# EAGLE design fpga_linux (EAGLE 9.3.2)
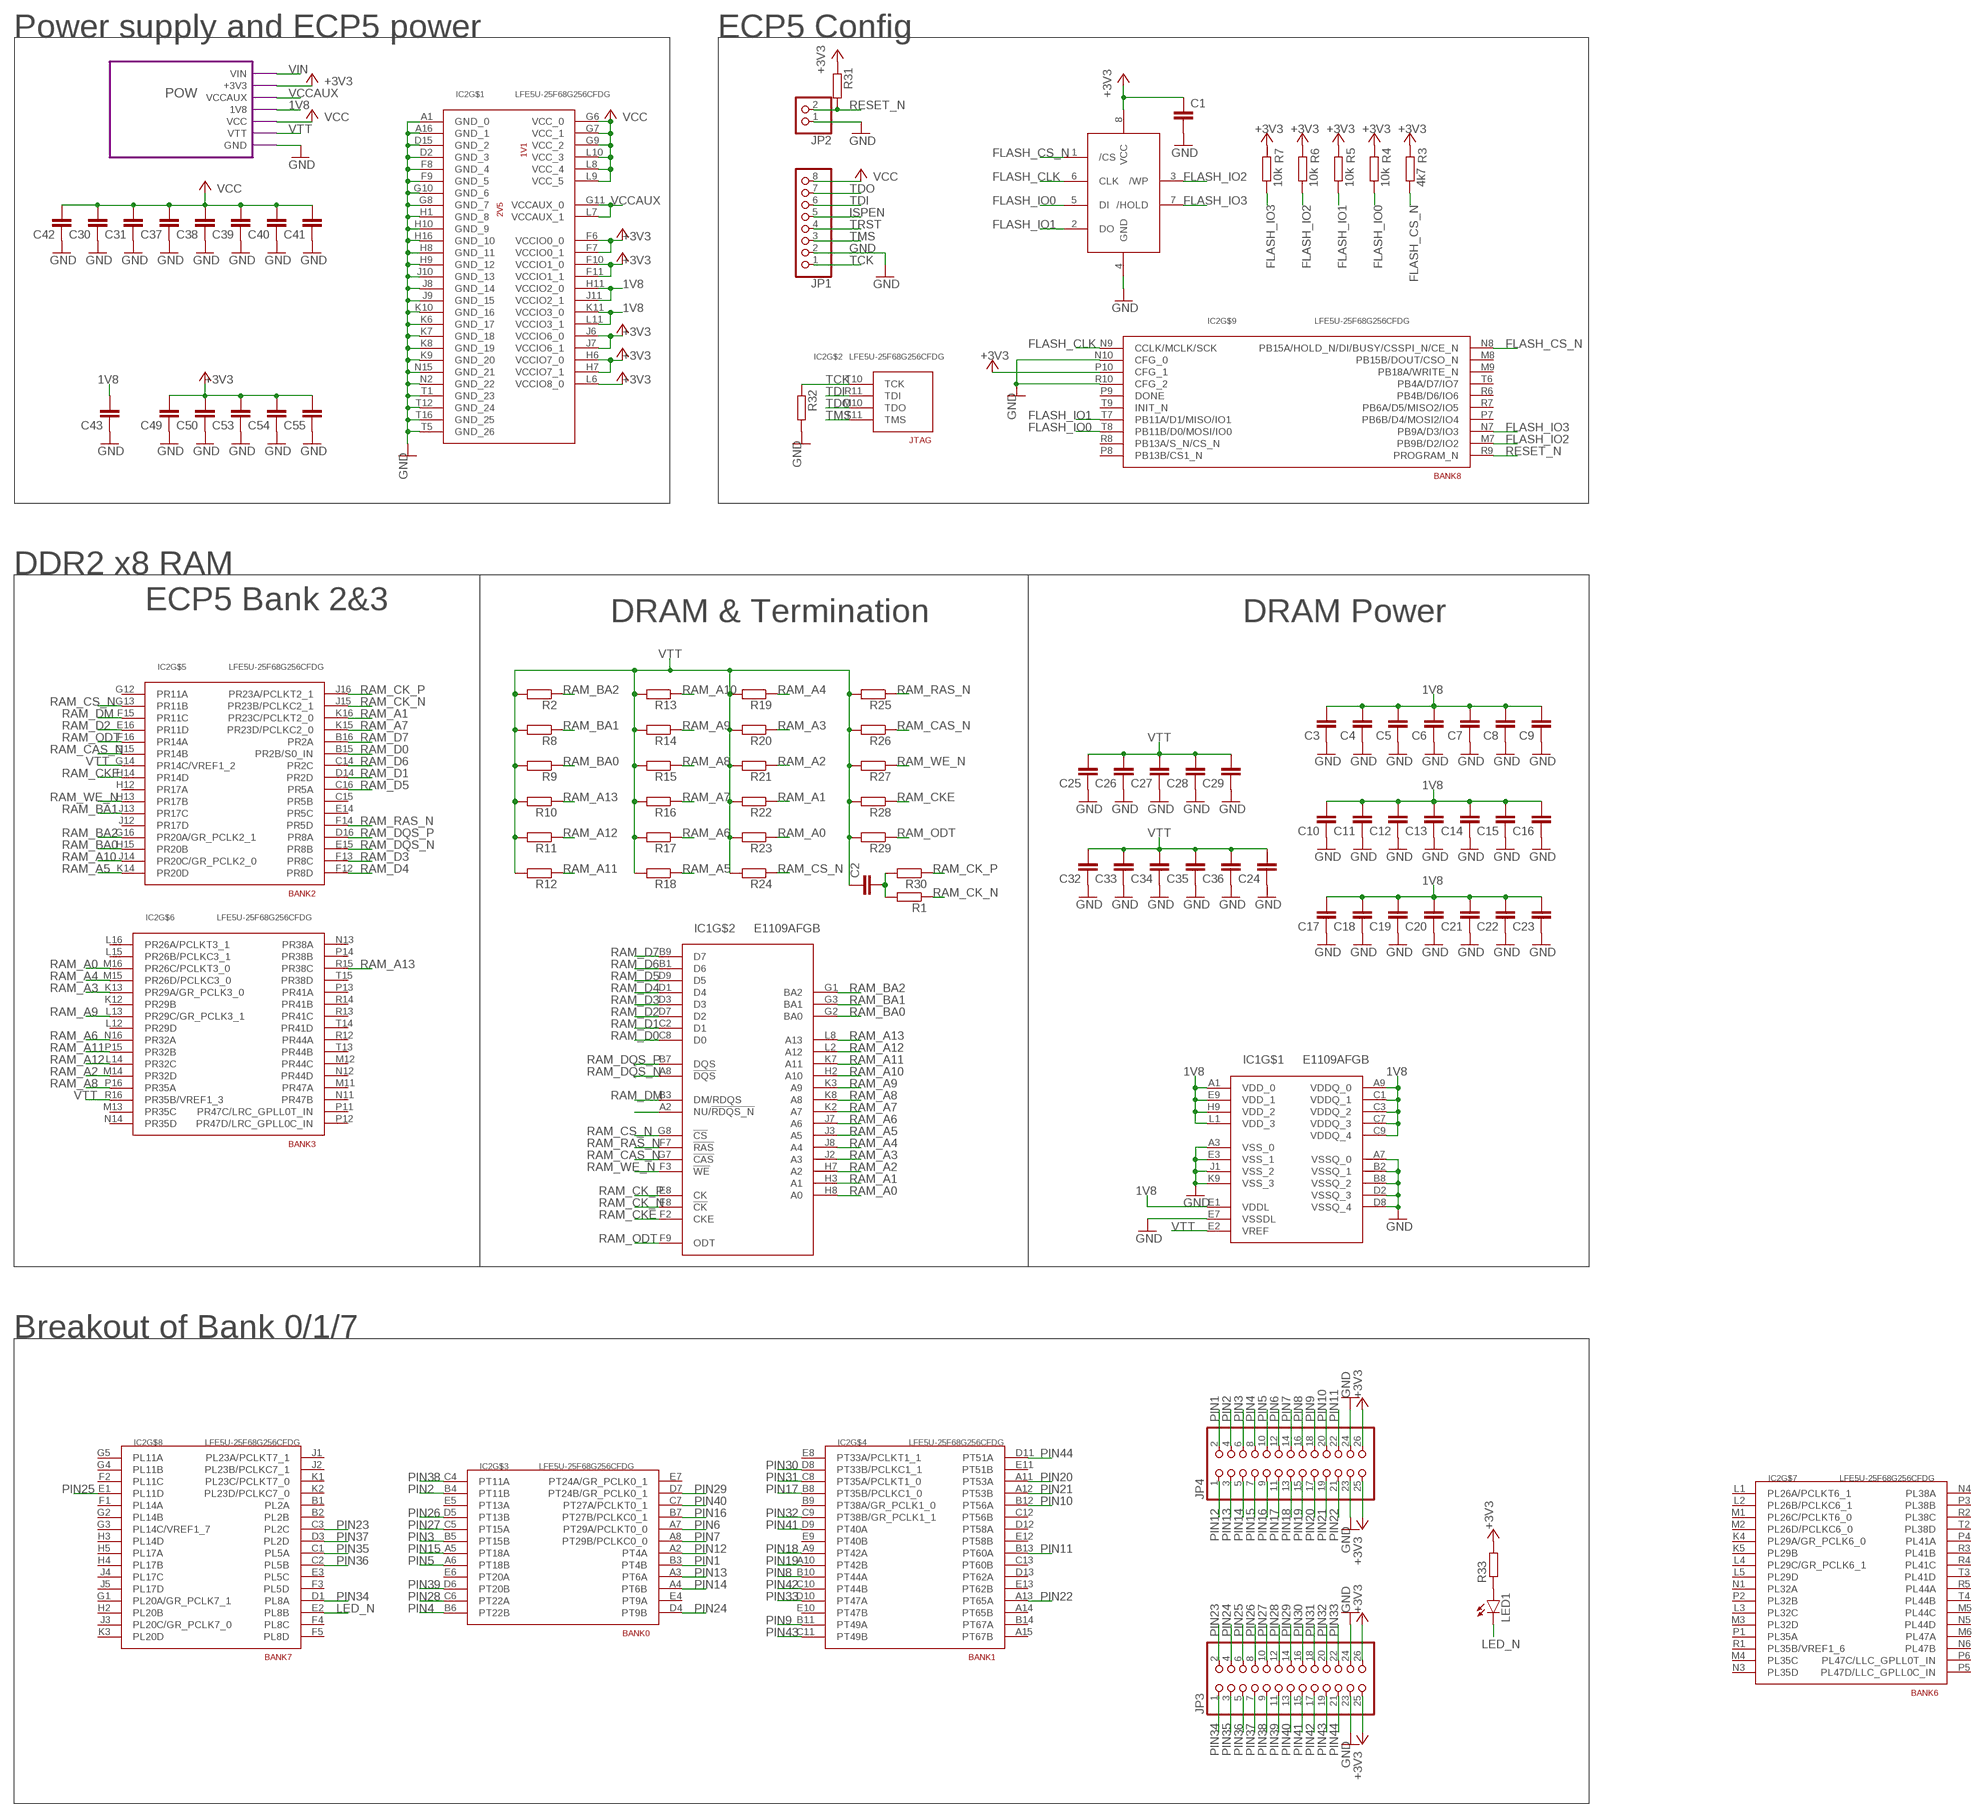
[diagram p0: schematic, sheet 1]

## Parts
C1  C0402  [0402]
C2  C0402  [0402]
C3  C0402  [0402]
C4  C0402  [0402]
C5  C0402  [0402]
C6  C0402  [0402]
C7  C0402  [0402]
C8  C0402  [0402]
C9  C0402  [0402]
C10  C0402  [0402]
C11  C0402  [0402]
C12  C0402  [0402]
C13  C0402  [0402]
C14  C0402  [0402]
C15  C0402  [0402]
C16  C0402  [0402]
C17  C0402  [0402]
C18  C0402  [0402]
C19  C0402  [0402]
C20  C0402  [0402]
C21  C0402  [0402]
C22  C0402  [0402]
C23  C0402  [0402]
C24  C0402  [0402]
C25  C0402  [0402]
C26  C0402  [0402]
C27  C0402  [0402]
C28  C0402  [0402]
C29  C0402  [0402]
C30  C0402  [0402]
C31  C0402  [0402]
C32  C0402  [0402]
C33  C0402  [0402]
C34  C0402  [0402]
C35  C0402  [0402]
C36  C0402  [0402]
C37  C0402  [0402]
C38  C0402  [0402]
C39  C0402  [0402]
C40  C0402  [0402]
C41  C0402  [0402]
C42  C0402  [0402]
C43  C0402  [0402]
C49  C0402  [0402]
C50  C0402  [0402]
C53  C0402  [0402]
C54  C0402  [0402]
C55  C0402  [0402]
IC1  E1109AFGB  [DDR2X8]
IC2  LFE5U-25F68G256CFDG  [BGA256C80P16X16_1400X1400X170]
JP1  PINHD-1X8  [1X08]
JP2  PINHD-1X2  [1X02]
JP3  PINHD-2X13  [2X13]
JP4  PINHD-2X13  [2X13]
LED1  LEDCHIP-LED0603  [CHIP-LED0603]
R1  R0402  [0402]
R2  R0402  [0402]
R3  4k7  R0402  [0402]
R4  10k  R0402  [0402]
R5  10k  R0402  [0402]
R6  10k  R0402  [0402]
R7  10k  R0402  [0402]
R8  R0402  [0402]
R9  R0402  [0402]
R10  R0402  [0402]
R11  R0402  [0402]
R12  R0402  [0402]
R13  R0402  [0402]
R14  R0402  [0402]
R15  R0402  [0402]
R16  R0402  [0402]
R17  R0402  [0402]
R18  R0402  [0402]
R19  R0402  [0402]
R20  R0402  [0402]
R21  R0402  [0402]
R22  R0402  [0402]
R23  R0402  [0402]
R24  R0402  [0402]
R25  R0402  [0402]
R26  R0402  [0402]
R27  R0402  [0402]
R28  R0402  [0402]
R29  R0402  [0402]
R30  R0402  [0402]
R31  R0402  [0402]
R32  R0402  [0402]
R33  R0402  [0402]
U$1  W25Q64FCSOIC8  [SOIC8]

## Module instances
POW = POW

## Nets
1V8: C3.2 C4.2 C5.2 C6.2 C7.2 C8.2 C9.2 C10.2 C11.2 C12.2 C13.2 C14.2 C15.2 C16.2 C17.2 C18.2 C19.2 C20.2 C21.2 C22.2 C23.2 C43.2 IC1.A1(VDD_0) IC1.A9(VDDQ_0) IC1.C1(VDDQ_1) IC1.C3(VDDQ_2) IC1.C7(VDDQ_3) IC1.C9(VDDQ_4) IC1.E1(VDDL) IC1.E9(VDD_1) IC1.H9(VDD_2) IC1.L1(VDD_3) IC2.H11(VCCIO2_0) IC2.J11(VCCIO2_1) IC2.K11(VCCIO3_0) IC2.L11(VCCIO3_1) ; port POW.1V8
+3V3: C1.1 C49.2 C50.2 C53.2 C54.2 C55.2 IC2.F6(VCCIO0_0) IC2.F7(VCCIO0_1) IC2.F10(VCCIO1_0) IC2.F11(VCCIO1_1) IC2.H6(VCCIO7_0) IC2.H7(VCCIO7_1) IC2.J6(VCCIO6_0) IC2.J7(VCCIO6_1) IC2.L6(VCCIO8_0) IC2.P10(CFG_1) JP3.25 JP3.26 JP4.25 JP4.26 R3.1 R4.1 R5.1 R6.1 R7.1 R31.2 R33.1 U$1.8(VCC) ; port POW.+3V3
FLASH_CLK: IC2.N9(CCLK/MCLK/SCK) U$1.6(CLK)
FLASH_CS_N: IC2.N8(PB15A/HOLD_N/DI/BUSY/CSSPI_N/CE_N) R3.2 U$1.1(/CS)
FLASH_IO0: IC2.T8(PB11B/D0/MOSI/IO0) R4.2 U$1.5(DI)
FLASH_IO1: IC2.T7(PB11A/D1/MISO/IO1) R5.2 U$1.2(DO)
FLASH_IO2: IC2.M7(PB9B/D2/IO2) R6.2 U$1.3(/WP)
FLASH_IO3: IC2.N7(PB9A/D3/IO3) R7.2 U$1.7(/HOLD)
GND: C1.2 C3.1 C4.1 C5.1 C6.1 C7.1 C8.1 C9.1 C10.1 C11.1 C12.1 C13.1 C14.1 C15.1 C16.1 C17.1 C18.1 C19.1 C20.1 C21.1 C22.1 C23.1 C24.1 C25.1 C26.1 C27.1 C28.1 C29.1 C30.1 C31.1 C32.1 C33.1 C34.1 C35.1 C36.1 C37.1 C38.1 C39.1 C40.1 C41.1 C42.1 C43.1 C49.1 C50.1 C53.1 C54.1 C55.1 IC1.A3(VSS_0) IC1.A7(VSSQ_0) IC1.B2(VSSQ_1) IC1.B8(VSSQ_2) IC1.D2(VSSQ_3) IC1.D8(VSSQ_4) IC1.E3(VSS_1) IC1.E7(VSSDL) IC1.J1(VSS_2) IC1.K9(VSS_3) IC2.A1(GND_0) IC2.A16(GND_1) IC2.D2(GND_3) IC2.D15(GND_2) IC2.F8(GND_4) IC2.F9(GND_5) IC2.G8(GND_7) IC2.G10(GND_6) IC2.H1(GND_8) IC2.H8(GND_11) IC2.H9(GND_12) IC2.H10(GND_9) IC2.H16(GND_10) IC2.J8(GND_14) IC2.J9(GND_15) IC2.J10(GND_13) IC2.K6(GND_17) IC2.K7(GND_18) IC2.K8(GND_19) IC2.K9(GND_20) IC2.K10(GND_16) IC2.N2(GND_22) IC2.N10(CFG_0) IC2.N15(GND_21) IC2.R10(CFG_2) IC2.T1(GND_23) IC2.T5(GND_26) IC2.T12(GND_24) IC2.T16(GND_25) JP1.2 JP2.1 JP3.23 JP3.24 JP4.23 JP4.24 R32.1 U$1.4(GND) ; port POW.GND
ISPEN: JP1.5
LED_N: IC2.E2(PL8B) LED1.C
N$1: C2.2 R1.1 R30.1
N$2: LED1.A R33.2
N$30: IC1.A2(NU/!RDQS_N)
PIN1: IC2.B3(PT4B) JP4.2
PIN2: IC2.B4(PT11B) JP4.4
PIN3: IC2.B5(PT15B) JP4.6
PIN4: IC2.B6(PT22B) JP4.8
PIN5: IC2.A6(PT18B) JP4.10
PIN6: IC2.A7(PT29A/PCLKT0_0) JP4.12
PIN7: IC2.A8(PT29B/PCLKC0_0) JP4.14
PIN8: IC2.B10(PT44A) JP4.16
PIN9: IC2.B11(PT49A) JP4.18
PIN10: IC2.B12(PT56A) JP4.20
PIN11: IC2.B13(PT60A) JP4.22
PIN12: IC2.A2(PT4A) JP4.1
PIN13: IC2.A3(PT6A) JP4.3
PIN14: IC2.A4(PT6B) JP4.5
PIN15: IC2.A5(PT18A) JP4.7
PIN16: IC2.B7(PT27B/PCLKC0_1) JP4.9
PIN17: IC2.B8(PT35B/PCLKC1_0) JP4.11
PIN18: IC2.A9(PT42A) JP4.13
PIN19: IC2.A10(PT42B) JP4.15
PIN20: IC2.A11(PT53A) JP4.17
PIN21: IC2.A12(PT53B) JP4.19
PIN22: IC2.A13(PT65A) JP4.21
PIN23: IC2.C3(PL2C) JP3.2
PIN24: IC2.D4(PT9B) JP3.4
PIN25: IC2.E1(PL11D) JP3.6
PIN26: IC2.D5(PT13B) JP3.8
PIN27: IC2.C5(PT15A) JP3.10
PIN28: IC2.C6(PT22A) JP3.12
PIN29: IC2.D7(PT24B/GR_PCLK0_1) JP3.14
PIN30: IC2.D8(PT33B/PCLKC1_1) JP3.16
PIN31: IC2.C8(PT35A/PCLKT1_0) JP3.18
PIN32: IC2.C9(PT38B/GR_PCLK1_1) JP3.20
PIN33: IC2.D10(PT47A) JP3.22
PIN34: IC2.D1(PL8A) JP3.1
PIN35: IC2.C1(PL5A) JP3.3
PIN36: IC2.C2(PL5B) JP3.5
PIN37: IC2.D3(PL2D) JP3.7
PIN38: IC2.C4(PT11A) JP3.9
PIN39: IC2.D6(PT20B) JP3.11
PIN40: IC2.C7(PT27A/PCLKT0_1) JP3.13
PIN41: IC2.D9(PT40A) JP3.15
PIN42: IC2.C10(PT44B) JP3.17
PIN43: IC2.C11(PT49B) JP3.19
PIN44: IC2.D11(PT51A) JP3.21
RAM_A0: IC1.H8(A0) IC2.M16(PR26C/PCLKT3_0) R23.2
RAM_A1: IC1.H3(A1) IC2.K16(PR23C/PCLKT2_0) R22.2
RAM_A2: IC1.H7(A2) IC2.M14(PR32D) R21.2
RAM_A3: IC1.J2(A3) IC2.K13(PR29A/GR_PCLK3_0) R20.2
RAM_A4: IC1.J8(A4) IC2.M15(PR26D/PCLKC3_0) R19.2
RAM_A5: IC1.J3(A5) IC2.K14(PR20D) R18.2
RAM_A6: IC1.J7(A6) IC2.N16(PR32A) R17.2
RAM_A7: IC1.K2(A7) IC2.K15(PR23D/PCLKC2_0) R16.2
RAM_A8: IC1.K8(A8) IC2.P16(PR35A) R15.2
RAM_A9: IC1.K3(A9) IC2.L13(PR29C/GR_PCLK3_1) R14.2
RAM_A10: IC1.H2(A10) IC2.J14(PR20C/GR_PCLK2_0) R13.2
RAM_A11: IC1.K7(A11) IC2.P15(PR32B) R12.2
RAM_A12: IC1.L2(A12) IC2.L14(PR32C) R11.2
RAM_A13: IC1.L8(A13) IC2.R15(PR38C) R10.2
RAM_BA0: IC1.G2(BA0) IC2.H15(PR20B) R9.2
RAM_BA1: IC1.G3(BA1) IC2.J13(PR17C) R8.2
RAM_BA2: IC1.G1(BA2) IC2.G16(PR20A/GR_PCLK2_1) R2.2
RAM_CAS_N: IC1.G7(!CAS) IC2.G15(PR14B) R26.2
RAM_CK_N: IC1.F8(!CK) IC2.J15(PR23B/PCLKC2_1) R1.2
RAM_CK_P [diff pairs]: IC1.E8(CK) IC2.J16(PR23A/PCLKT2_1) R30.2
RAM_CKE: IC1.F2(CKE) IC2.H14(PR14D) R28.2
RAM_CS_N: IC1.G8(!CS) IC2.G13(PR11B) R24.2
RAM_D0: IC1.C8(D0) IC2.B15(PR2B/S0_IN)
RAM_D1: IC1.C2(D1) IC2.D14(PR2D)
RAM_D2: IC1.D7(D2) IC2.E16(PR11D)
RAM_D3: IC1.D3 IC2.F13(PR8C)
RAM_D4: IC1.D1(D4) IC2.F12(PR8D)
RAM_D5: IC1.D9(D5) IC2.C16(PR5A)
RAM_D6: IC1.B1(D6) IC2.C14(PR2C)
RAM_D7: IC1.B9(D7) IC2.B16(PR2A)
RAM_DM: IC1.B3(DM/RDQS) IC2.F15(PR11C)
RAM_DQS_N: IC1.A8(!DQS) IC2.E15(PR8B)
RAM_DQS_P: IC1.B7(DQS) IC2.D16(PR8A)
RAM_ODT: IC1.F9(ODT) IC2.F16(PR14A) R29.2
RAM_RAS_N: IC1.F7(!RAS) IC2.F14(PR5D) R25.2
RAM_WE_N: IC1.F3(!WE) IC2.H13(PR17B) R27.2
RESET_N: IC2.R9(PROGRAM_N) JP2.2 R31.1
TCK: IC2.T10(TCK) JP1.1 R32.2
TDI: IC2.R11(TDI) JP1.6
TDO: IC2.M10(TDO) JP1.7
TMS: IC2.T11(TMS) JP1.3
TRST: JP1.4
VCC: C30.2 C31.2 C37.2 C38.2 C39.2 C40.2 C41.2 C42.2 IC2.G6(VCC_0) IC2.G7(VCC_1) IC2.G9(VCC_2) IC2.L8(VCC_4) IC2.L9(VCC_5) IC2.L10(VCC_3) JP1.8 ; port POW.VCC
VCCAUX: IC2.G11(VCCAUX_0) IC2.L7(VCCAUX_1) ; port POW.VCCAUX
VIN: port POW.VIN
VTT: C2.1 C24.2 C25.2 C26.2 C27.2 C28.2 C29.2 C32.2 C33.2 C34.2 C35.2 C36.2 IC1.E2(VREF) IC2.G14(PR14C/VREF1_2) IC2.R16(PR35B/VREF1_3) R2.1 R8.1 R9.1 R10.1 R11.1 R12.1 R13.1 R14.1 R15.1 R16.1 R17.1 R18.1 R19.1 R20.1 R21.1 R22.1 R23.1 R24.1 R25.1 R26.1 R27.1 R28.1 R29.1 ; port POW.VTT
Unconnected: IC2.A14(PT65B) IC2.A15(PT67B) IC2.B1(PL2A) IC2.B2(PL2B) IC2.B9(PT38A/GR_PCLK1_0) IC2.B14(PT67A) IC2.C12(PT56B) IC2.C13(PT60B) IC2.C15(PR5B) IC2.D12(PT58A) IC2.D13(PT62A) IC2.E3(PL5C) IC2.E4(PT9A) IC2.E5(PT13A) IC2.E6(PT20A) IC2.E7(PT24A/GR_PCLK0_1) IC2.E8(PT33A/PCLKT1_1) IC2.E9(PT40B) IC2.E10(PT47B) IC2.E11(PT51B) IC2.E12(PT58B) IC2.E13(PT62B) IC2.E14(PR5C) IC2.F1(PL14A) IC2.F2(PL11C) IC2.F3(PL5D) IC2.F4(PL8C) IC2.F5(PL8D) IC2.G1(PL20A/GR_PCLK7_1) IC2.G2(PL14B) IC2.G3(PL14C/VREF1_7) IC2.G4(PL11B) IC2.G5(PL11A) IC2.G12(PR11A) IC2.H2(PL20B) IC2.H3(PL14D) IC2.H4(PL17B) IC2.H5(PL17A) IC2.H12(PR17A) IC2.J1(PL23A/PCLKT7_1) IC2.J2(PL23B/PCLKC7_1) IC2.J3(PL20C/GR_PCLK7_0) IC2.J4(PL17C) IC2.J5(PL17D) IC2.J12(PR17D) IC2.K1(PL23C/PCLKT7_0) IC2.K2(PL23D/PCLKC7_0) IC2.K3(PL20D) IC2.K4(PL29A/GR_PCLK6_0) IC2.K5(PL29B) IC2.K12(PR29B) IC2.L1(PL26A/PCLKT6_1) IC2.L2(PL26B/PCLKC6_1) IC2.L3(PL32C) IC2.L4(PL29C/GR_PCLK6_1) IC2.L5(PL29D) IC2.L12(PR29D) IC2.L15(PR26B/PCLKC3_1) IC2.L16(PR26A/PCLKT3_1) IC2.M1(PL26C/PCLKT6_0) IC2.M2(PL26D/PCLKC6_0) IC2.M3(PL32D) IC2.M4(PL35C) IC2.M5(PL44C) IC2.M6(PL47A) IC2.M8(PB15B/DOUT/CSO_N) IC2.M9(PB18A/WRITE_N) IC2.M11(PR47A) IC2.M12(PR44C) IC2.M13(PR35C) IC2.N1(PL32A) IC2.N3(PL35D) IC2.N4(PL38A) IC2.N5(PL44D) IC2.N6(PL47B) IC2.N11(PR47B) IC2.N12(PR44D) IC2.N13(PR38A) IC2.N14(PR35D) IC2.P1(PL35A) IC2.P2(PL32B) IC2.P3(PL38B) IC2.P4(PL41A) IC2.P5(PL47D/LLC_GPLL0C_IN) IC2.P6(PL47C/LLC_GPLL0T_IN) IC2.P7(PB6B/D4/MOSI2/IO4) IC2.P8(PB13B/CS1_N) IC2.P9(DONE) IC2.P11(PR47C/LRC_GPLL0T_IN) IC2.P12(PR47D/LRC_GPLL0C_IN) IC2.P13(PR41A) IC2.P14(PR38B) IC2.R1(PL35B/VREF1_6) IC2.R2(PL38C) IC2.R3(PL41B) IC2.R4(PL41C) IC2.R5(PL44A) IC2.R6(PB4B/D6/IO6) IC2.R7(PB6A/D5/MISO2/IO5) IC2.R8(PB13A/S_N/CS_N) IC2.R12(PR44A) IC2.R13(PR41C) IC2.R14(PR41B) IC2.T2(PL38D) IC2.T3(PL41D) IC2.T4(PL44B) IC2.T6(PB4A/D7/IO7) IC2.T9(INIT_N) IC2.T13(PR44B) IC2.T14(PR41D) IC2.T15(PR38D)

## Notes on the sheet
- Power supply and ECP5 power | ECP5 Config
- DDR2 x8 RAM
- ECP5 Bank 2&3
- DRAM & Termination | DRAM Power
- Breakout of Bank 0/1/7

## Library data of the parts
C1-C43 C49 C50 C53-C55 = my_lib:C
IC1 = my_lib:E1109AFGB: 1G bits DDR2 SDRAM EDE1108AFBG (128M words × 8 bits)
IC2 = my_lib:LFE5U-25F68G256C: ECP5 in caBGA256 package with 25K LUTs 3.744Mb block-memory
JP1 = pinhead:PINHD-1X8: PIN HEADER
JP2 = pinhead:PINHD-1X2: PIN HEADER
JP3 JP4 = pinhead:PINHD-2X13: PIN HEADER
LED1 = led:LED: LED OSRAM: - CHIPLED LG R971, LG N971, LY N971, LG Q971, LY Q971, LO R971, LY R971 LH N974, LH R974 LS Q976, LO Q976, LY Q976 LO Q996 - Hyper CHIPLED LW Q18S LB Q993, LB Q99A, LB R99A - SideLED LS A670, LO A670, LY A670, LG A670, LP A670 LB A673, LV A673, LT A673, LW A673 LH A674 LY A675 LS A676, LA A676, LO A676, LY A676, LW A676 LS A679, LY A679, LG A679 - Hyper Micro SIDELED® LS Y876, LA Y876, LO Y876, LY Y876 LT Y87S - SmartLED LW L88C, LW L88S LB L89C, LB L89S, LG L890 LS L89K, LO L89K, LY L89K LS L896, LA L896, LO L896, LY L896 - TOPLED LS T670, LO T670, LY T670, LG T670, LP T670 LSG T670, LSP T670, LSY T670, LOP T670, LYG T670 LG T671, LOG T671, LSG T671 LB T673, LV T673, LT T673, LW T673 LH T674 LS T676, LA T676, LO T676, LY T676, LB T676, LH T676, LSB T676, LW T676 LB T67C, LV T67C, LT T67C, LS T67K, LO T67K, LY T67K, LW E67C LS E67B, LA E67B, LO E67B, LY E67B, LB E67C, LV E67C, LT E67C LW T67C LS T679, LY T679, LG T679 LS T770, LO T770, LY T770, LG T770, LP T770 LB T773, LV T773, LT T773, LW T773 LH T774 LS E675, LA E675, LY E675, LS T675 LS T776, LA T776, LO T776, LY T776, LB T776 LHGB T686 LT T68C, LB T68C - Hyper Mini TOPLED® LB M676 - Mini TOPLED Santana® LG M470 LS M47K, LO M47K, LY M47K Source: http://www.osram.convergy.de LUXEON: - LUMILED® LXK2-PW12-R00, LXK2-PW12-S00, LXK2-PW14-U00, LXK2-PW14-V00 LXK2-PM12-R00, LXK2-PM12-S00, LXK2-PM14-U00 LXK2-PE12-Q00, LXK2-PE12-R00, LXK2-PE12-S00, LXK2-PE14-T00, LXK2-PE14-U00 LXK2-PB12-K00, LXK2-PB12-L00, LXK2-PB12-M00, LXK2-PB14-N00, LXK2-PB14-P00, LXK2-PB14-Q00 LXK2-PR12-L00, LXK2-PR12-M00, LXK2-PR14-Q00, LXK2-PR14-R00 LXK2-PD12-Q00, LXK2-PD12-R00, LXK2-PD12-S00 LXK2-PH12-R00, LXK2-PH12-S00 LXK2-PL12-P00, LXK2-PL12-Q00, LXK2-PL12-R00 Source: www.luxeon.com KINGBRIGHT: KA-3528ASYC Source: www.kingbright.com
R1-R33 = my_lib:R
U$1 = my_lib:W25Q64FC: 64Mbit Serial Flash

## Module POW
Ports: VIN(io) +3V3(io) VCCAUX(io) VCC(io) GND(io) 1V8(io) VTT(io)
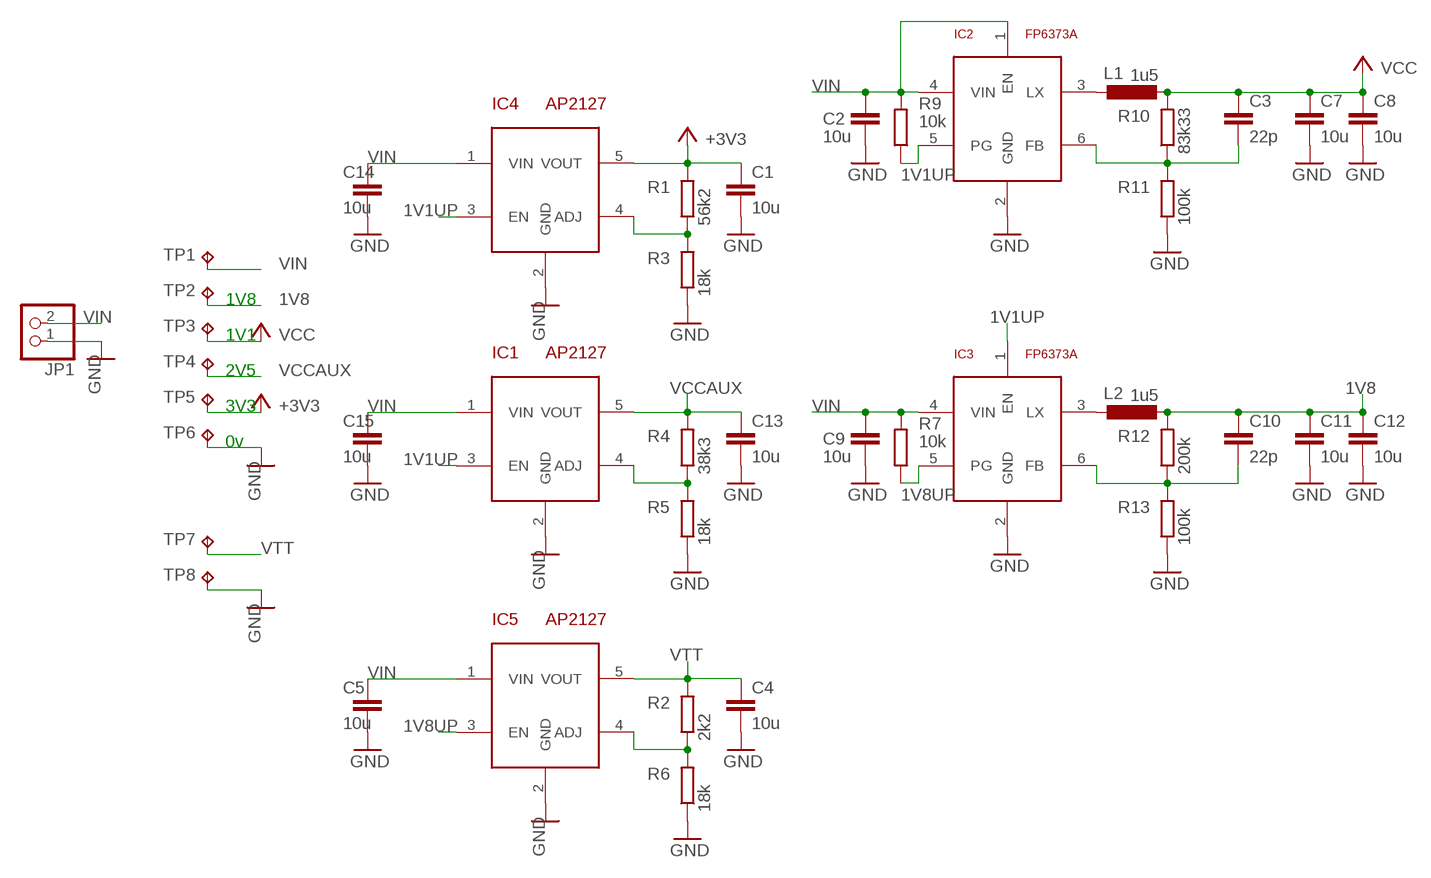
[diagram p1: schematic, module POW, sheet 1]

### Parts
C1  10u  C1206  [1206]
C2  10u  C1206  [1206]
C3  22p  C0402  [0402]
C4  10u  C1206  [1206]
C5  10u  C1206  [1206]
C7  10u  C1206  [1206]
C8  10u  C1206  [1206]
C9  10u  C1206  [1206]
C10  22p  C0402  [0402]
C11  10u  C1206  [1206]
C12  10u  C1206  [1206]
C13  10u  C1206  [1206]
C14  10u  C1206  [1206]
C15  10u  C1206  [1206]
IC1  AP2127  [SOT23-5]
IC2  FP6373A  [SOT23-6]
IC3  FP6373A  [SOT23-6]
IC4  AP2127  [SOT23-5]
IC5  AP2127  [SOT23-5]
JP1  PINHD-1X2/90  [1X02/90]
L1  1u5  L0805  [0805]
L2  1u5  L0805  [0805]
R1  56k2  R0402  [0402]
R2  2k2  R0402  [0402]
R3  18k  R0402  [0402]
R4  38k3  R0402  [0402]
R5  18k  R0402  [0402]
R6  18k  R0402  [0402]
R7  10k  R0402  [0402]
R9  10k  R0402  [0402]
R10  83k33  R0402  [0402]
R11  100k  R0402  [0402]
R12  200k  R0402  [0402]
R13  100k  R0402  [0402]
TP1  TPB1,27  [B1,27]
TP2  TPB1,27  [B1,27]
TP3  TPB1,27  [B1,27]
TP4  TPB1,27  [B1,27]
TP5  TPB1,27  [B1,27]
TP6  TPB1,27  [B1,27]
TP7  TPB1,27  [B1,27]
TP8  TPB1,27  [B1,27]

### Nets
1V1UP: IC1.3(EN) IC2.5(PG) IC3.1(EN) IC4.3(EN) R9.2
1V8: C10.1 C11.1 C12.1 L2.2 R12.1 TP2.TP
1V8UP: IC3.5(PG) IC5.3(EN) R7.2
+3V3: C1.1 IC4.5(VOUT) R1.1 TP5.TP
GND: C1.2 C2.2 C4.2 C5.2 C7.2 C8.2 C9.2 C11.2 C12.2 C13.2 C14.2 C15.2 IC1.2(GND) IC2.2(GND) IC3.2(GND) IC4.2(GND) IC5.2(GND) JP1.1 R3.2 R5.2 R6.2 R11.2 R13.2 TP6.TP TP8.TP
N$1: IC1.4(ADJ) R4.2 R5.1
N$2: IC3.3(LX) L2.1
N$3: C3.2 IC2.6(FB) R10.2 R11.1
N$4: IC2.3(LX) L1.1
N$5: IC4.4(ADJ) R1.2 R3.1
N$6: IC5.4(ADJ) R2.2 R6.1
N$7: C10.2 IC3.6(FB) R12.2 R13.1
VCC: C3.1 C7.1 C8.1 L1.2 R10.1 TP3.TP
VCCAUX: C13.1 IC1.5(VOUT) R4.1 TP4.TP
VIN: C2.1 C5.1 C9.1 C14.1 C15.1 IC1.1(VIN) IC2.1(EN) IC2.4(VIN) IC3.4(VIN) IC4.1(VIN) IC5.1(VIN) JP1.2 R7.1 R9.1 TP1.TP
VTT: C4.1 IC5.5(VOUT) R2.1 TP7.TP

### Notes on the sheet
- 1V8
- 1V1
- 2V5
- 3V3
- 0v

### Library data of the parts
C1-C5 C7-C15 = my_lib:C
IC1 IC4 IC5 = my_lib:AP2127: 300mA HIGH SPEED, EXTREMELY LOW NOISE CMOS LDO REGULATOR ADJ=0.8V
IC2 IC3 = my_lib:FP6373A: High Efficiency 1MHz 3A Synchronous Step Down Regulator
JP1 = pinhead:PINHD-1X2: PIN HEADER
L1 L2 = my_lib:L
R1-R7 R9-R13 = my_lib:R
TP1-TP8 = testpad:TP: Test pad

## Net classes
1 diff pairs: width 0.127 mm, drill 0.2 mm, clearance 0.089 mm

## Board
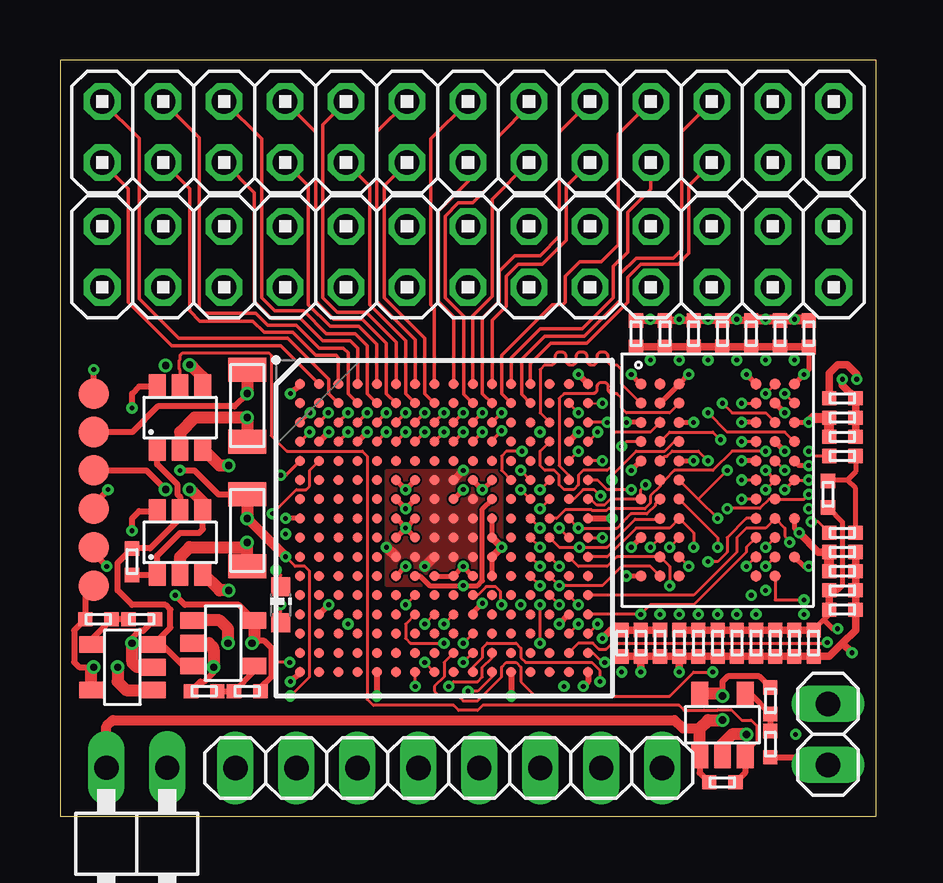
[diagram p2: board, top side]
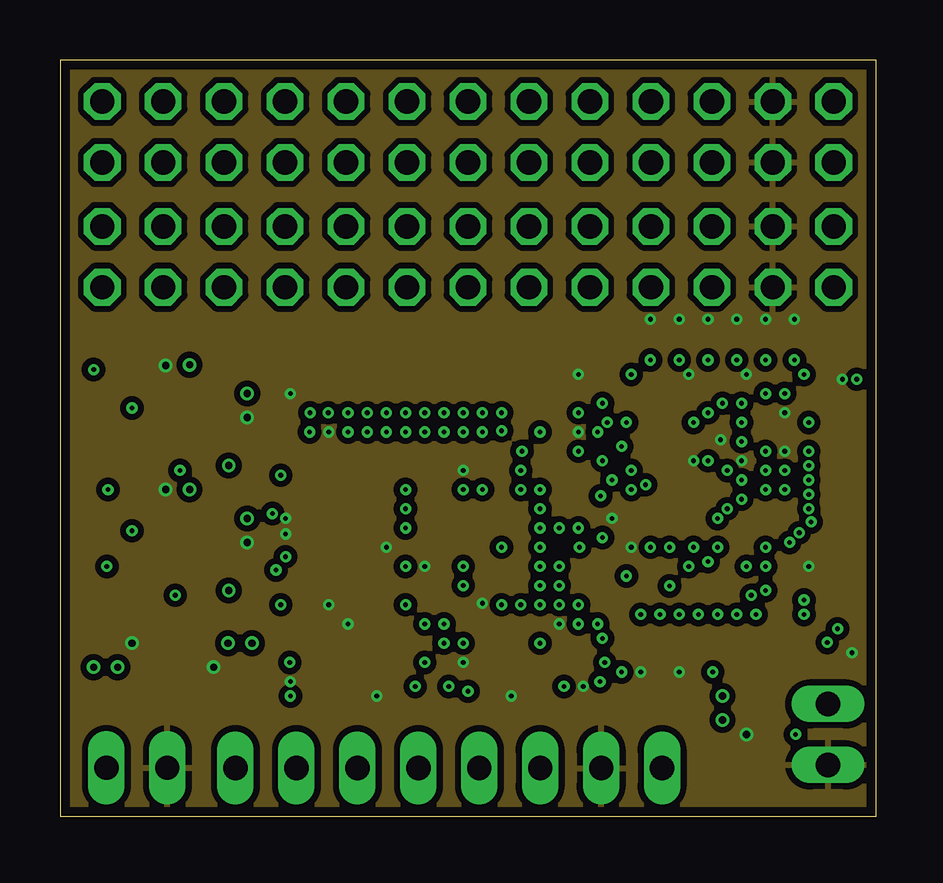
[diagram p3: board, inner layer Route2]
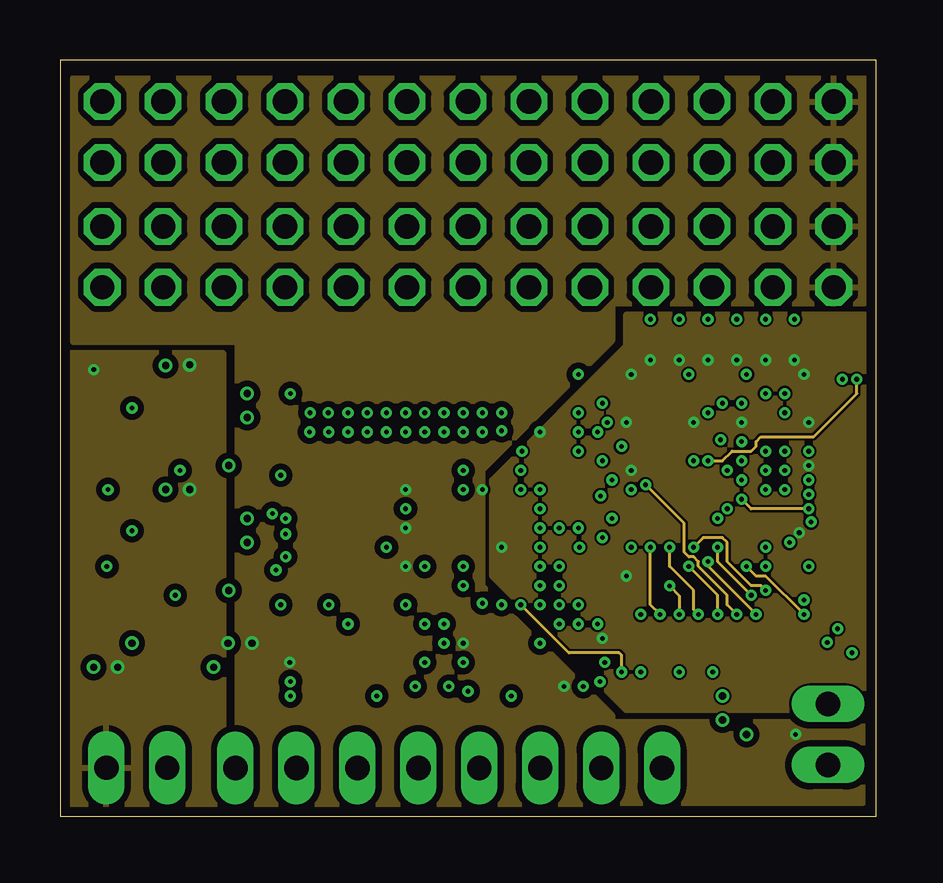
[diagram p4: board, inner layer Route15]
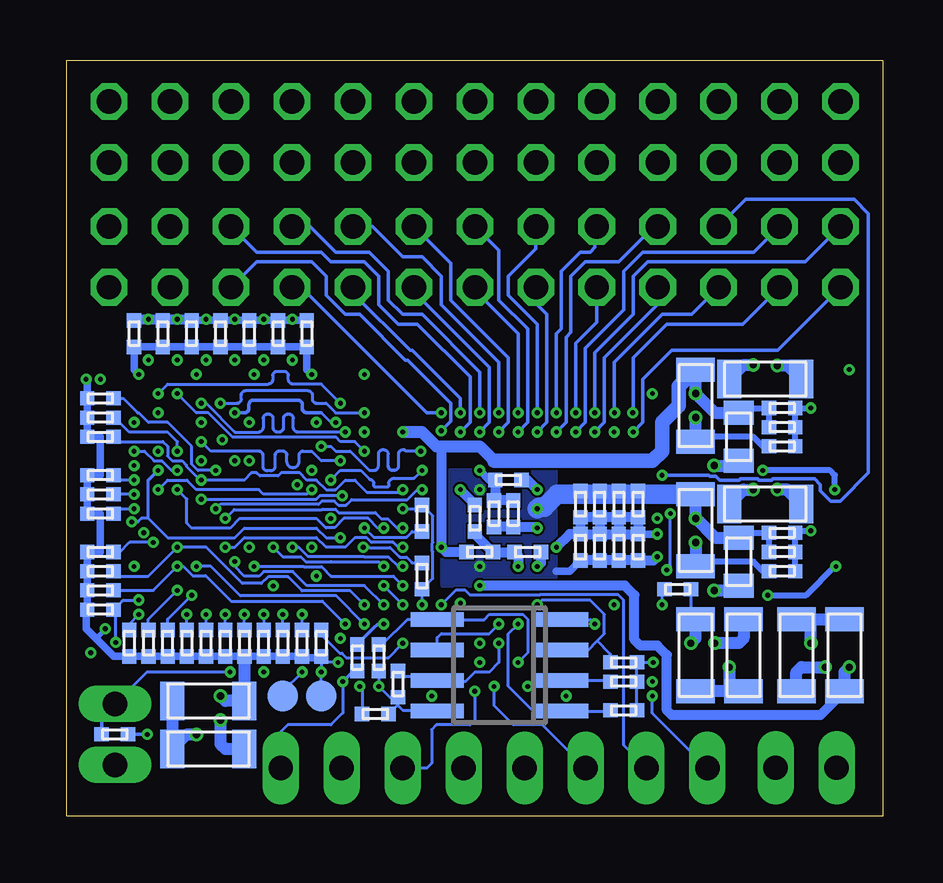
[diagram p5: board, bottom side, seen from below]

Size 34 x 31.5 mm. Coordinates in mm from the lower left corner, seen from the top.
Outline: 0,0 34,0 34,31.5 0,31.5 0,0
Copper layers (1+2*15+16): Top 0.035mm / dielectric 0.2mm / Route2 0.0175mm / dielectric 1.065mm / Route15 0.0175mm / dielectric 0.2mm / Bottom 0.035mm
Design rules "default *": minimum track width 3.5mil, minimum drill 0.2mm, track to track 3.5mil, track to pad 3.5mil, pad to pad 3.5mil, via to via 3.5mil, smd to smd 1mil, copper to edge 0.4mm, drill to drill 5mil, minimum pad ring 0.13mm, minimum via ring 0.13mm, stop-mask expansion 2mil, vias tented up to drill 0.25mm, thermal gap 10mil

### Footprints (pad centres in the part's own frame; a part is rotated, then mirrored left to right if it is on the bottom)
0402 = smd 0.59 x 0.6: 1 0,0.55; 2 0,-0.55
DDR2X8 = smd 0.45 x 0.45: A1 -3.2,4; A2 -2.4,4; A3 -1.6,4; A7 1.6,4; A8 2.4,4; A9 3.2,4; B1 -3.2,3.2; B2 -2.4,3.2; B3 -1.6,3.2; B7 1.6,3.2; B8 2.4,3.2; B9 3.2,3.2; C1 -3.2,2.4; C2 -2.4,2.4; C3 -1.6,2.4; C7 1.6,2.4; C8 2.4,2.4; C9 3.2,2.4; D1 -3.2,1.6; D2 -2.4,1.6; D3 -1.6,1.6; D7 1.6,1.6; D8 2.4,1.6; D9 3.2,1.6; E1 -3.2,0.8; E2 -2.4,0.8; E3 -1.6,0.8; E7 1.6,0.8; E8 2.4,0.8; E9 3.2,0.8; F2 -2.4,0; F3 -1.6,0; F7 1.6,0; F8 2.4,0; F9 3.2,0; G1 -3.2,-0.8; G2 -2.4,-0.8; G3 -1.6,-0.8; G7 1.6,-0.8; G8 2.4,-0.8; H2 -2.4,-1.6; H3 -1.6,-1.6; H7 1.6,-1.6; H8 2.4,-1.6; H9 3.2,-1.6; J1 -3.2,-2.4; J2 -2.4,-2.4; J3 -1.6,-2.4; J7 1.6,-2.4; J8 2.4,-2.4; K2 -2.4,-3.2; K3 -1.6,-3.2; K7 1.6,-3.2; K8 2.4,-3.2; K9 3.2,-3.2; L1 -3.2,-4; L2 -2.4,-4; L3 -1.6,-4; L7 1.6,-4; L8 2.4,-4
BGA256C80P16X16_1400X1400X170 = smd 0.41 x 0.41: A1 -6,6; A2 -5.2,6; A3 -4.4,6; A4 -3.6,6; A5 -2.8,6; A6 -2,6; A7 -1.2,6; A8 -0.4,6; A9 0.4,6; A10 1.2,6; A11 2,6; A12 2.8,6; A13 3.6,6; A14 4.4,6; A15 5.2,6; A16 6,6; B1 -6,5.2; B2 -5.2,5.2; B3 -4.4,5.2; B4 -3.6,5.2; B5 -2.8,5.2; B6 -2,5.2; B7 -1.2,5.2; B8 -0.4,5.2; B9 0.4,5.2; B10 1.2,5.2; B11 2,5.2; B12 2.8,5.2; B13 3.6,5.2; B14 4.4,5.2; B15 5.2,5.2; B16 6,5.2; C1 -6,4.4; C2 -5.2,4.4; C3 -4.4,4.4; C4 -3.6,4.4; C5 -2.8,4.4; C6 -2,4.4; C7 -1.2,4.4; C8 -0.4,4.4; C9 0.4,4.4; C10 1.2,4.4; C11 2,4.4; C12 2.8,4.4; C13 3.6,4.4; C14 4.4,4.4; C15 5.2,4.4; C16 6,4.4; D1 -6,3.6; D2 -5.2,3.6; D3 -4.4,3.6; D4 -3.6,3.6; D5 -2.8,3.6; D6 -2,3.6; D7 -1.2,3.6; D8 -0.4,3.6; D9 0.4,3.6; D10 1.2,3.6; D11 2,3.6; D12 2.8,3.6; D13 3.6,3.6; D14 4.4,3.6; D15 5.2,3.6; D16 6,3.6; E1 -6,2.8; E2 -5.2,2.8; E3 -4.4,2.8; E4 -3.6,2.8; E5 -2.8,2.8; E6 -2,2.8; E7 -1.2,2.8; E8 -0.4,2.8; E9 0.4,2.8; E10 1.2,2.8; E11 2,2.8; E12 2.8,2.8; E13 3.6,2.8; E14 4.4,2.8; E15 5.2,2.8; E16 6,2.8; F1 -6,2; F2 -5.2,2; F3 -4.4,2; F4 -3.6,2; F5 -2.8,2; F6 -2,2; F7 -1.2,2; F8 -0.4,2; F9 0.4,2; F10 1.2,2; F11 2,2; F12 2.8,2; F13 3.6,2; F14 4.4,2; F15 5.2,2; F16 6,2; G1 -6,1.2; G2 -5.2,1.2; G3 -4.4,1.2; G4 -3.6,1.2; G5 -2.8,1.2; G6 -2,1.2; G7 -1.2,1.2; G8 -0.4,1.2; G9 0.4,1.2; G10 1.2,1.2; G11 2,1.2; G12 2.8,1.2; G13 3.6,1.2; G14 4.4,1.2; G15 5.2,1.2; G16 6,1.2; H1 -6,0.4; H2 -5.2,0.4; H3 -4.4,0.4; H4 -3.6,0.4; H5 -2.8,0.4; H6 -2,0.4; H7 -1.2,0.4; H8 -0.4,0.4; H9 0.4,0.4; H10 1.2,0.4; H11 2,0.4; H12 2.8,0.4; H13 3.6,0.4; H14 4.4,0.4; H15 5.2,0.4; H16 6,0.4; J1 -6,-0.4; J2 -5.2,-0.4; J3 -4.4,-0.4; J4 -3.6,-0.4; J5 -2.8,-0.4; J6 -2,-0.4; J7 -1.2,-0.4; J8 -0.4,-0.4; J9 0.4,-0.4; J10 1.2,-0.4; J11 2,-0.4; J12 2.8,-0.4; J13 3.6,-0.4; J14 4.4,-0.4; J15 5.2,-0.4; J16 6,-0.4; K1 -6,-1.2; K2 -5.2,-1.2; K3 -4.4,-1.2; K4 -3.6,-1.2; K5 -2.8,-1.2; K6 -2,-1.2; K7 -1.2,-1.2; K8 -0.4,-1.2; K9 0.4,-1.2; K10 1.2,-1.2; K11 2,-1.2; K12 2.8,-1.2; K13 3.6,-1.2; K14 4.4,-1.2; K15 5.2,-1.2; K16 6,-1.2; L1 -6,-2; L2 -5.2,-2; L3 -4.4,-2; L4 -3.6,-2; L5 -2.8,-2; L6 -2,-2; L7 -1.2,-2; L8 -0.4,-2; L9 0.4,-2; L10 1.2,-2; L11 2,-2; L12 2.8,-2; L13 3.6,-2; L14 4.4,-2; L15 5.2,-2; L16 6,-2; M1 -6,-2.8; M2 -5.2,-2.8; M3 -4.4,-2.8; M4 -3.6,-2.8; M5 -2.8,-2.8; M6 -2,-2.8; M7 -1.2,-2.8; M8 -0.4,-2.8; M9 0.4,-2.8; M10 1.2,-2.8; M11 2,-2.8; M12 2.8,-2.8; M13 3.6,-2.8; M14 4.4,-2.8; M15 5.2,-2.8; M16 6,-2.8; N1 -6,-3.6; N2 -5.2,-3.6; N3 -4.4,-3.6; N4 -3.6,-3.6; N5 -2.8,-3.6; N6 -2,-3.6; N7 -1.2,-3.6; N8 -0.4,-3.6; N9 0.4,-3.6; N10 1.2,-3.6; N11 2,-3.6; N12 2.8,-3.6; N13 3.6,-3.6; N14 4.4,-3.6; N15 5.2,-3.6; N16 6,-3.6; P1 -6,-4.4; P2 -5.2,-4.4; P3 -4.4,-4.4; P4 -3.6,-4.4; P5 -2.8,-4.4; P6 -2,-4.4; P7 -1.2,-4.4; P8 -0.4,-4.4; P9 0.4,-4.4; P10 1.2,-4.4; P11 2,-4.4; P12 2.8,-4.4; P13 3.6,-4.4; P14 4.4,-4.4; P15 5.2,-4.4; P16 6,-4.4; R1 -6,-5.2; R2 -5.2,-5.2; R3 -4.4,-5.2; R4 -3.6,-5.2; R5 -2.8,-5.2; R6 -2,-5.2; R7 -1.2,-5.2; R8 -0.4,-5.2; R9 0.4,-5.2; R10 1.2,-5.2; R11 2,-5.2; R12 2.8,-5.2; R13 3.6,-5.2; R14 4.4,-5.2; R15 5.2,-5.2; R16 6,-5.2; T1 -6,-6; T2 -5.2,-6; T3 -4.4,-6; T4 -3.6,-6; T5 -2.8,-6; T6 -2,-6; T7 -1.2,-6; T8 -0.4,-6; T9 0.4,-6; T10 1.2,-6; T11 2,-6; T12 2.8,-6; T13 3.6,-6; T14 4.4,-6; T15 5.2,-6; T16 6,-6
1X08 = drill 1.016 long: 1 -8.89,0; 2 -6.35,0; 3 -3.81,0; 4 -1.27,0; 5 1.27,0; 6 3.81,0; 7 6.35,0; 8 8.89,0
1X02 = drill 1.016 long: 1 -1.27,0; 2 1.27,0
2X13 = drill 1.016 octagon: 1 -15.24,-1.27; 2 -15.24,1.27; 3 -12.7,-1.27; 4 -12.7,1.27; 5 -10.16,-1.27; 6 -10.16,1.27; 7 -7.62,-1.27; 8 -7.62,1.27; 9 -5.08,-1.27; 10 -5.08,1.27; 11 -2.54,-1.27; 12 -2.54,1.27; 13 0,-1.27; 14 0,1.27; 15 2.54,-1.27; 16 2.54,1.27; 17 5.08,-1.27; 18 5.08,1.27; 19 7.62,-1.27; 20 7.62,1.27; 21 10.16,-1.27; 22 10.16,1.27; 23 12.7,-1.27; 24 12.7,1.27; 25 15.24,-1.27; 26 15.24,1.27
CHIP-LED0603 = smd 0.8 x 0.8: A 0,-0.75; C 0,0.75
1206 = smd 1.6 x 1: 1 0,1.6; 2 0,-1.4
SOT23-5 = smd 0.7 x 1: 1 -0.95,-1.3; 2 0,-1.3; 3 0.95,-1.3; 4 0.95,1.3; 5 -0.95,1.3
SOT23-6 = smd 0.7 x 1: 1 -0.95,-1.3; 2 0,-1.3; 3 0.95,-1.3; 4 0.95,1.3; 5 0,1.3; 6 -0.95,1.3
1X02/90 = drill 1.016 long: 1 -1.27,-3.81; 2 1.27,-3.81
0805 = smd 1.25 x 1: 1 0,1; 2 0,-1
B1,27 = smd 1.27 x 1.27: TP 0,0
SOIC8 = smd 0.6 x 2.2: 1 -1.905,-2.6; 2 -0.635,-2.6; 3 0.635,-2.6; 4 1.905,-2.6; 5 1.905,2.6; 6 0.635,2.6; 7 -0.635,2.6; 8 -1.905,2.6

### Placement (x,y rotation side)
C1  21.15,4.25 270 bottom
C2  32,13.4 180 top
C3  31.2,20.1 0 bottom
C4  31.2,20.1 0 top
C5  30,20.1 0 bottom
C6  30,20.1 0 top
C7  28.8,20.1 0 bottom
C8  28.8,20.1 0 top
C9  27.6,20.1 0 bottom
C10  27.6,20.1 0 top
C11  26.4,20.1 0 bottom
C12  26.4,20.1 0 top
C13  25.2,20.1 0 bottom
C14  25.2,20.1 0 top
C15  24,20.1 0 bottom
C16  24,20.1 0 top
C17  32.6,16.6 270 top
C18  25,7.2 180 top
C19  32.6,15.8 270 top
C20  23.4,7.2 180 top
C21  32.6,11 270 top
C22  24.2,7.2 180 top
C23  32.6,10.2 270 top
C24  29.8,7.2 180 top
C25  25.8,7.2 180 top
C26  32.6,17.4 270 top
C27  32.6,9.4 270 top
C28  26.6,7.2 180 top
C29  28.2,7.2 180 top
C30  11,13 180 bottom
C31  10.2,13 180 bottom
C32  27.4,7.2 180 top
C33  32.6,8.6 270 top
C34  30.6,7.2 180 top
C35  29,7.2 180 top
C36  31.4,7.2 180 top
C37  11.8,13 180 bottom
C38  12.6,13 180 bottom
C39  12.6,11.2 0 bottom
C40  11,11.2 0 bottom
C41  11.8,11.2 0 bottom
C42  10.2,11.2 0 bottom
C43  16.8,11 270 bottom
C49  15.4,12.6 0 bottom
C50  16.2,12.6 0 bottom
C53  17,12.4 180 bottom
C54  15.6,14 90 bottom
C55  14.8,11 90 bottom
IC1  27.4,14 0 top
IC2  16,12 0 top
JP1  16.2,2 180 top
JP2  32,3.4 90 top
JP3  17,23.3 0 top
JP4  17,28.5 0 top
LED1  9.2,8.8 0 top
POW:C1  10u  [1206]  7.8,6.6 0 bottom
POW:C2  10u  [1206]  4.8,13 90 bottom
POW:C3  22p  [0402]  4.2,11.8 90 bottom
POW:C4  10u  [1206]  28.2,4.8 270 bottom
POW:C5  10u  [1206]  28.2,2.8 270 bottom
POW:C7  10u  [1206]  7.8,11.8 0 bottom
POW:C8  10u  [1206]  7.8,11.8 0 top
POW:C9  10u  [1206]  4.8,18.2 90 bottom
POW:C10  22p  [0402]  4.2,17 90 bottom
POW:C11  10u  [1206]  7.8,17 0 bottom
POW:C12  10u  [1206]  7.8,17 0 top
POW:C13  10u  [1206]  1.6,6.8 180 bottom
POW:C14  10u  [1206]  3.6,6.8 180 bottom
POW:C15  10u  [1206]  5.8,6.6 0 bottom
POW:IC1  AP2127  [SOT23-5]  2.6,6.2 90 top
POW:IC2  FP6373A  [SOT23-6]  5,11.4 0 top
POW:IC3  FP6373A  [SOT23-6]  5,16.6 0 top
POW:IC4  AP2127  [SOT23-5]  6.8,7.2 270 top
POW:IC5  AP2127  [SOT23-5]  27.6,3.8 0 top
POW:JP1  [1X02/90]  3.2,-1.8 180 top
POW:L1  1u5  [0805]  6,10.6 180 bottom
POW:L2  1u5  [0805]  6,15.8 180 bottom
POW:R1  56k2  [0402]  7.8,5.2 270 top
POW:R2  2k2  [0402]  29.6,4.8 0 top
POW:R3  18k  [0402]  6,5.2 270 top
POW:R4  38k3  [0402]  1.6,8.2 90 top
POW:R5  18k  [0402]  3.4,8.2 90 top
POW:R6  18k  [0402]  29.6,3 0 top
POW:R7  10k  [0402]  27.6,1.4 90 top
POW:R9  10k  [0402]  3,10.6 180 top
POW:R10  83k33  [0402]  4.2,11 90 bottom
POW:R11  100k  [0402]  4.2,10.2 270 bottom
POW:R12  200k  [0402]  4.2,16.2 90 bottom
POW:R13  100k  [0402]  4.2,15.4 270 bottom
POW:TP1  TPB1,27  [B1,27]  1.4,17.6 0 top
POW:TP2  TPB1,27  [B1,27]  1.4,16 0 top
POW:TP3  TPB1,27  [B1,27]  1.4,12.8 0 top
POW:TP4  TPB1,27  [B1,27]  1.4,9.6 0 top
POW:TP5  TPB1,27  [B1,27]  1.4,11.2 0 top
POW:TP6  TPB1,27  [B1,27]  1.4,14.4 0 top
POW:TP7  TPB1,27  [B1,27]  23.4,5 0 bottom
POW:TP8  TPB1,27  [B1,27]  25,5 0 bottom
R1  32.6,15 270 top
R2  28.2,7.2 180 bottom
R3  10.8,4.4 270 bottom
R4  21,6.6 180 bottom
R5  10.8,5.6 270 bottom
R6  10.8,6.4 270 bottom
R7  20.2,5.5 180 bottom
R8  29.8,7.2 180 bottom
R9  19.2,12.4 0 bottom
R10  32.6,8.6 90 bottom
R11  23.4,7.2 180 bottom
R12  31.4,7.2 180 bottom
R13  19.2,10 180 bottom
R14  27.4,7.2 180 bottom
R15  32.6,9.4 90 bottom
R16  25.8,7.2 180 bottom
R17  24.2,7.2 180 bottom
R18  26.6,7.2 180 bottom
R19  32.6,10.2 90 bottom
R20  25,7.2 180 bottom
R21  29,7.2 180 bottom
R22  30.6,7.2 180 bottom
R23  32.6,11 90 bottom
R24  32.6,13.4 90 bottom
R25  32.6,15.8 90 bottom
R26  32.6,12.6 90 bottom
R27  32.6,17.4 90 bottom
R28  32.6,16.6 90 bottom
R29  32.6,14.2 90 bottom
R30  32.6,11.8 270 top
R31  32,3.4 90 bottom
R32  21.9,6.6 0 bottom
R33  8.55,9.45 270 bottom
U$1  15.97,6.28 90 bottom

### Tracks (layer width: path | path; a pad name or v marks a point on that pad's centre or on a via)
1V8  (via drill 0.2, 0.3)
  Top 0.203: IC2.J11 IC2.H11 | IC1.L1 v23.6,10 | IC1.E1 v23.8,14.4 | IC1.C1 v23.6,16.4 | IC1.A1 v23.8,18.4 | IC1.A9 v31,18.4 31.2,18.6 C4.2 | IC1.C9 v31.2,16.4 | IC1.C7 v28.4,16.4 | v31.2,14.6 30.8,14.6 IC1.E9 | v30.8,11.8 30.6,12 IC1.H9 | IC1.C3 v26.4,16.4 | IC2.L11 IC2.K11
  Top 0.254: v7.8,17.6 7.27,17.07 4.07,17.07 3,16 POW:TP2.TP
  Top 0.305: C15.2 C14.2 C12.2 C10.2 C8.2 C6.2 C4.2 | v30.8,11.8 31.6,11 C21.2 | C18.2 C22.2 C20.2 22.95,7.75 v22.6,7.4 | IC2.J11 v18.4,11.2 IC2.K11
  Top 0.406: C19.2 C17.2 31.4,16.6 v31.2,16.4 | C23.2 C21.2
  Top 0.508: POW:C11.1 v7.8,17.6
  Bottom 0.254: POW:L2.2 5.8,17 POW:C10.1 POW:R12.1
  Bottom 0.305: v23.8,18.4 24,18.6 C15.2 C14.2 C12.2 C10.2 C8.2 C6.2 C4.2 31.2,18.6 v31,18.4
  Bottom 0.406: 17.8,15.4 18.4,15.4 18.4,12.86 v18.4,11.2 18.2,11 C43.2
  Bottom 0.508: POW:C11.1 v7.8,17.6 7,16.8 POW:L2.2 | 16.2,14.8 16.8,15.4 17.8,15.4 18.6,15.4 19.2,16 v20,16 | 8.6,17 8.5,17.1
  Bottom 0.61: POW:C11.1 8.5,17.9 8.5,17.1 | 16.2,14.8 9.6,14.8 9.2,15.2 9.2,16.4 8.6,17
  other vias: 24.6,19 25.8,19 27,19 28.2,19 29.4,19 30.6,19
  pour Route15 (isolate 0.089): 18,14 23.6,19.6 23.6,20.9 33.55,20.9 33.55,4.4 23.6,4.4 18,10
+3V3  (via drill 0.2, 0.3)
  Top 0.127: IC2.P10 v16.8,7.2 | v9.57,6.4 8.82,6.4
  Top 0.203: IC2.H6 v14.4,12 | v14.4,12 IC2.J7 | IC2.J6 v14.4,12 | IC2.H7 v14.4,12 | IC2.L6 v14.4,10.4 | IC2.F6 v14.4,13.6 IC2.F7 | IC2.F10 v17.6,13.6 IC2.F11
  Top 0.254: POW:R1.1 8.35,5.34 8.82,5.81 8.82,6.4 8.82,6.98 8.5,7.3 8.1,7.3 | POW:IC4.5 7.45,8.8 5.2,8.8 v4.8,9.2 | v1.95,10.4 1.4,10.95 POW:TP5.TP
  Top 0.508: POW:IC4.5 8.1,7.3 v8,7.2
  Bottom 0.127: U$1.8 18.59,4.4 20,4.4 20.2,4.6 | R3.1 R5.1 R6.1 v9.57,6.4 | R4.1 v21,5.4 20.55,4.95 R7.1 20.2,4.6 | C1.1 20.25,4.6 20.2,4.6 | R33.1 8,8.4 POW:C1.1
  Bottom 0.152: R31.2 v30.65,3.4
  Bottom 0.254: v4.8,9.2 3.2,9.2 2,10.4 v1.95,10.4
  Bottom 0.406: C50.2 C49.2 14.45,12.05 v14.4,12 | C54.2 IC2.F7 v14.4,13.6 | C53.2 17,13 v17.6,13.6 | C55.2 14.25,10.55 v14.4,10.4
  Bottom 0.508: v8,7.2 7.8,7.4 POW:C1.1
  pour Route15 (isolate 0.254, no thermals): 7.4,21.2 23,21.2 23,19.8 17.6,14.4 17.6,9.6 23,4.2 23,0.45 7.4,0.45
  pour Route15 (isolate 0.254): 7.4,19.75 0.55,19.75 0.55,20.3 0.55,30.75 5.7,30.75 33.5,30.75 33.5,21.35 23,21.35 23,19.9 7.45,19.9 7.45,19.75
  pour Route15 (isolate 0.254): 23,0.55 33.45,0.55 33.45,3.9 23,3.9
FLASH_CLK  (via drill 0.2)
  Top 0.127: v16,8 IC2.N9
  Bottom 0.127: U$1.6 18.57,7.43 18.4,7.6 16.4,7.6 v16,8
FLASH_CS_N  (via drill 0.2)
  Top 0.127: v15.2,8 IC2.N8
  Bottom 0.127: v15.2,8 15.6,7.6 15.6,5.4 14.6,4.4 13.39,4.4 U$1.1 11.38,4.38 R3.2
FLASH_IO0  (via drill 0.2)
  Top 0.127: v15.2,6.4 IC2.T8
  Bottom 0.127: v15.2,6.4 14.8,6.8 14.8,8.2 15,8.4 16.4,8.4 16.61,8.19 U$1.5 19.82,8.19 20.85,7.15 R4.2
FLASH_IO1  (via drill 0.2)
  Top 0.127: v14.8,5.4 IC2.T7
  Bottom 0.127: v14.8,5.4 14.55,5.64 U$1.2 11.39,5.64 R5.2
FLASH_IO2  (via drill 0.2)
  Top 0.127: v14.4,8.8 IC2.M7
  Bottom 0.127: U$1.3 12.29,6.91 11.9,7.3 | v14.4,8.8 14.2,9 12.2,9 11.6,8.4 11.6,7.6 11.9,7.3 | R6.2 11.35,6.75 11.9,7.3
FLASH_IO3  (via drill 0.2)
  Top 0.127: IC2.N7 14.4,8 14.4,7.4 14.6,7.2 v16,7.2
  Bottom 0.127: v16,7.2 16,6.4 16.4,6 17,6 17.4,5.6 18.52,5.6 U$1.7 18.73,5.8 20,5.8 20.2,6 R7.2
GND  (via drill 0.2, 0.3)
  Top 0.127: IC2.R10 v16.8,6.4 | IC1.D2 25.4,16 27.2,16 v27.52,15.68
  Top 0.203: IC2.H1 v9.4,12.4 | IC1.E3 v26.4,14.8 | IC1.E7 v28.4,14.8 | v31.2,10.4 31,10.4 IC1.K9 | IC1.J1 v23.8,11.2 | v26.2,18.4 IC1.A3 IC1.B2 | IC1.A7 v28.6,18.4 | IC1.B8 v30.2,16.8 | IC1.D8 v30.2,15.2 | IC2.N10 17.2,8.46 v17.6,8.86
  Top 0.254: POW:R3.2 5.85,5.6 6.01,5.6 6.4,5.99 v6.4,6.2 | POW:R5.2 3.47,7.72 3.31,7.72 3,7.4 v3,7.2 | POW:TP6.TP 3.6,14.4 v4.4,13.6 | IC2.A1 v9.6,17.6 | IC2.D2 v11.2,16 | IC2.A16 v21.6,18.4 | IC2.H16 v23,12.4 | IC2.N15 v20.8,8 | IC2.T16 22,5.6 v21.8,5.4 | IC2.T12 v18.8,5 | IC2.T1 v9.6,5.6 | IC2.T5 v13.2,5 | IC2.N2 v11.2,8.8 | IC2.D15 v21.6,16 | POW:R6.2 32,2.45 JP2.1
  Top 0.305: C20.1 C22.1 | C22.1 C18.1 C25.1 | C25.1 C28.1 C32.1 C29.1 | C29.1 C35.1 C34.1 | C34.1 C36.1 32.05,6.65 32.6,7.2 | 32.6,7.2 33.15,7.75 C33.1 C27.1 C23.1 C21.1 | C22.1 v24.2,6 | C29.1 C24.1 C34.1 | C25.1 v25.8,6 | 32.6,7.2 v33,6.8 | C19.1 C17.1 C26.1 32.6,17.95 v32.6,18.2 | C16.1 C14.1 C11.1 C9.1 C8.1 | v16.8,14.4 IC2.F9
  Top 0.406: C8.1 28.85,20.7 v29.4,20.7 29.95,20.7 C6.1 30.05,20.7 v30.6,20.7 31.15,20.7 C4.1 | v13.6,11.2 IC2.K6 | v15.2,10.4 IC2.K8
  Top 0.508: POW:IC4.2 6.2,7.2 6.38,7.02 6.38,6.94 6.4,6.92 v6.4,6.2 | POW:IC1.2 3.2,6.2 3.02,6.38 3.02,6.46 3,6.48 v3,7.2 | POW:C8.2 7.8,11.2 | 7.8,11.2 v7.8,11.4 | POW:IC2.2 5,10.8 5.4,11.2 7.8,11.2 | POW:C12.2 v7.8,16.6 5.6,16.6 5,16 POW:IC3.2 | v28.6,3.4 28,3.4 27.6,3 POW:IC5.2
  Bottom 0.127: U$1.4 12.18,8.19 v12,8 | v21.8,5.4 21.7,5.3 C1.2 | POW:TP8.TP 25,5.2 v24.2,6
  Bottom 0.152: v20.8,8 21.05,8 21.2,7.84 21.44,7.61 21.45,7.61 R32.1
  Bottom 0.254: POW:R11.2 5,10.2 5.4,10.6 7.8,10.6 | POW:R13.2 5,15.4 5.4,15.8 7.6,15.8 POW:C12.2
  Bottom 0.305: C16.1 C14.1 C11.1 C9.1 C8.1 | C54.1 IC2.F9 v16.8,14.4 | C42.1 v9.4,11.75
  Bottom 0.406: C4.1 31.15,20.7 v30.6,20.7 30.05,20.7 C6.1 29.95,20.7 v29.4,20.7 28.85,20.7 C8.1 | C30.1 C31.1 C42.1 C40.1 | C30.1 C37.1 | C37.1 C38.1 C39.1 | C39.1 C41.1 | C41.1 C40.1 | C30.1 C40.1 | C37.1 C41.1 | C39.1 13.05,11.75 v13.6,11.2 | C53.1 17,11.75 C43.1 C55.1 15.2,10.85 v15.2,10.4 | C49.1 C50.1 16.15,13.2 C54.1
  Bottom 0.508: v6.4,6.2 6.4,5.2 POW:C15.2 POW:C1.2 | v3,7.2 3,8.2 | 3,8.2 POW:C13.2 | POW:C14.2 3,8.2 | v7.8,11.4 7.8,10.6 POW:C8.2 | POW:C2.2 4,13.6 v4.4,13.6 | POW:C12.2 v7.8,16.6 | POW:C9.2 3.97,18.77 v4.4,18.77 | POW:C4.2 POW:C5.2 29,3.4 v28.6,3.4
  other vias: 24.6,20.7 25.8,20.7 27,20.7 28.2,20.7
  pour Route2 (isolate 0.254): 0.45,31.05 33.55,31.05 33.55,0.45 0.45,0.45
  pour Top (no thermals): 13.6,14.4 18.4,14.4 18.4,9.6 13.6,9.6
LED_N  (via drill 0.2)
  Top 0.127: LED1.C 9.2,10.05 v9,10.25 | v8.85,12.6 9.85,13.6 10.25,13.6 10.4,13.75 10.4,14.4 IC2.E2
  Bottom 0.127: v9,10.25 8.85,10.4 v8.85,12.6
N$1
  Top 0.203: C2.2 32.1,13.95 32.15,14 32.8,14 | R30.1 33.15,13.65 32.8,14 | R1.1 33.15,14.35 32.8,14
N$2  (via drill 0.2)
  Top 0.127: LED1.A v9.2,8.8
  Bottom 0.127: v9.2,8.8 9.2,9.35 R33.2
PIN1
  Top 0.152: JP4.2 3.3,28.23 3.3,21.55 4.94,19.91 9.49,19.91 11.2,18.2 11.2,17.6 IC2.B3
PIN2
  Top 0.152: JP4.4 5.8,28.27 5.8,21.15 6,20.95 8.15,20.95 8.65,20.45 9.85,20.45 10.8,19.5 11.8,19.5 12,19.3 12,17.6 IC2.B4
PIN3
  Top 0.152: JP4.6 8.4,28.21 8.4,21.6 8.95,21.05 10.15,21.05 11.1,20.1 12.3,20.1 12.8,19.6 12.8,17.6 IC2.B5
PIN4
  Top 0.152: JP4.8 10.65,28.5 10.65,21.45 11.4,20.7 12.6,20.7 13.6,19.7 13.6,17.6 IC2.B6
PIN5
  Top 0.152: JP4.10 10.95,28.8 10.95,21.6 11.55,21 12.75,21 14,19.75 IC2.A6
PIN6
  Top 0.152: JP4.12 13.2,28.51 13.2,21.45 14.8,19.85 IC2.A7
PIN7
  Top 0.152: JP4.14 15.45,28.22 15.45,21.3 15.6,21.15 IC2.A8
PIN8
  Top 0.152: JP4.16 19.54,29.59 18.25,28.3 18.25,26.6 17.2,25.55 16.6,25.55 16.05,25 16.05,21.6 16.83,20.82 16.83,17.57 IC2.B10
PIN9
  Top 0.152: JP4.18 20.8,28.49 20.8,24.15 20,23.35 18.95,23.35 18.3,22.7 18.3,21.45 17.6,20.75 17.6,17.6 IC2.B11
PIN10
  Top 0.152: JP4.20 23.25,28.4 23.25,23.8 22.55,23.1 21.65,23.1 21.05,22.5 21.05,21.4 20.95,21.3 20.5,21.3 18.4,19.2 18.4,17.6 IC2.B12
PIN11
  Top 0.152: JP4.22 25.9,28.51 25.9,23.6 25.55,23.25 24,23.25 23.35,22.6 23.35,21.5 21.85,20 20.2,20 19.23,19.03 19.23,17.57 IC2.B13
PIN12
  Top 0.152: JP4.1 2.85,26.14 2.85,21.4 4.65,19.6 9.2,19.6 IC2.A2
PIN13
  Top 0.152: JP4.3 5.4,26.13 5.4,21.05 5.82,20.62 8.03,20.62 8.5,20.15 9.7,20.15 10.65,19.2 11.5,19.2 11.6,19.1 IC2.A3
PIN14
  Top 0.152: JP4.5 8.1,25.97 8.1,21.45 8.8,20.75 10,20.75 10.95,19.8 12.1,19.8 12.4,19.5 IC2.A4
PIN15
  Top 0.152: JP4.7 10.35,26.26 10.35,21.3 11.25,20.4 12.45,20.4 13.2,19.65 IC2.A5
PIN16
  Top 0.152: JP4.9 12.9,26.25 12.9,21.3 14.4,19.8 14.4,17.6 IC2.B7
PIN17
  Top 0.152: JP4.11 13.5,26.27 13.5,21.6 15.2,19.9 15.2,17.6 IC2.B8
PIN18
  Top 0.152: JP4.13 17,26.45 15.75,25.2 15.75,21.45 16.4,20.8 IC2.A9
PIN19
  Top 0.152: JP4.15 18,25.69 18,21.65 17.2,20.85 IC2.A10
PIN20
  Top 0.152: JP4.17 21.1,26.25 21.1,24 20.1,23 19.1,23 18.6,22.5 18.6,21.25 18,20.65 IC2.A11
PIN21
  Top 0.152: JP4.19 24.62,26.12 23.65,25.15 23.65,23.5 23.05,22.9 23.05,21.6 21.75,20.3 20.01,20.3 18.8,19.09 IC2.A12
PIN22
  Top 0.152: JP4.21 26.2,26.27 26.2,23.45 25.75,23 24.2,23 23.65,22.45 23.65,21.4 21.95,19.7 20.45,19.7 19.6,18.85 IC2.A13
PIN23  (via drill 0.2)
  Top 0.152: v12,16.8 IC2.C3
  Bottom 0.152: JP3.2 3.23,23.1 9.8,23.1 10.4,22.5 10.4,20.9 12,19.3 v12,16.8
PIN24  (via drill 0.2)
  Top 0.203: v12.8,16 IC2.D4
  Bottom 0.152: JP3.4 5.37,23.5 10,23.5 10.8,22.7 10.8,21.1 12.4,19.5 12.4,16.4 v12.8,16
PIN25  (via drill 0.2)
  Top 0.152: IC2.E1 9.4,14.2 v9.2,14.2
  Bottom 0.152: JP3.6 5.71,25.7 1.2,25.7 0.6,25.1 0.6,14.3 1.78,13.12 2.18,13.12 2.6,13.55 2.6,13.8 2.85,14.04 4.58,14.04 4.63,14 5.17,14 5.22,14.04 5.95,14.04 5.99,14 6.8,14 6.96,14.15 7.21,14.15 7.26,14.2 v9.2,14.2
PIN26  (via drill 0.2)
  Top 0.152: v13.6,16 IC2.D5
  Bottom 0.152: v13.6,16 13.2,16.4 13.2,19.95 13,20.15 13,22.5 12.4,23.1 11,23.1 9.53,24.57 JP3.8
PIN27  (via drill 0.2)
  Top 0.152: v13.6,16.8 IC2.C5
  Bottom 0.152: JP3.10 12,24.49 12,23.7 12.2,23.5 12.6,23.5 13.4,22.7 13.4,20.3 13.6,20.1 v13.6,16.8
PIN28  (via drill 0.2)
  Top 0.152: v14.4,16.8 IC2.C6
  Bottom 0.152: JP3.12 14.46,23.64 15.6,22.5 15.6,21.7 14.4,20.5 v14.4,16.8
PIN29  (via drill 0.2)
  Top 0.152: v15.2,16 IC2.D7
  Bottom 0.152: JP3.14 16,23.57 16,21.5 14.8,20.3 14.8,16.4 v15.2,16
PIN30  (via drill 0.2)
  Top 0.152: v16,16 IC2.D8
  Bottom 0.152: JP3.16 18,23.03 18,21.5 15.6,19.1 15.6,16.4 v16,16
PIN31  (via drill 0.2)
  Top 0.152: v16,16.8 IC2.C8
  Bottom 0.152: v16,16.8 16,18.9 18.4,21.3 18.4,22.5 19.2,23.3 20,23.3 21.27,24.57 JP3.18
PIN32  (via drill 0.2)
  Top 0.152: v16.8,16.8 IC2.C9
  Bottom 0.152: v16.8,16.8 16.8,18.5 19.2,20.9 20,20.9 20.6,21.5 20.6,22.7 21.4,23.5 22.8,23.5 23.87,24.57 JP3.20
PIN33  (via drill 0.2)
  Top 0.152: v17.6,16 IC2.D10
  Bottom 0.152: JP3.22 26.09,23.5 23.4,23.5 23,23.1 21.61,23.1 21,22.49 21,21.3 20.2,20.5 19.4,20.5 17.2,18.3 17.2,16.4 v17.6,16
PIN34  (via drill 0.2)
  Top 0.152: v10.4,16 IC2.D1
  Bottom 0.152: JP3.1 4.39,19.4 8.8,19.4 10,18.2 10,16.4 v10.4,16
PIN35  (via drill 0.2)
  Top 0.152: v10.42,16.8 10.02,16.4
  Top 0.203: 10.02,16.4 IC2.C1
  Bottom 0.152: JP3.3 5.83,20.5 9,20.5 10.4,19.1 10.4,16.8
  Bottom 0.203: 10.4,16.8 v10.42,16.8
PIN36  (via drill 0.2)
  Top 0.152: 11.18,16.78 IC2.C2
  Top 0.203: v11.18,16.8 11.18,16.78
  Bottom 0.152: JP3.5 7.97,20.9 9.2,20.9 11.2,18.9 11.2,16.8
  Bottom 0.203: 11.2,16.8 v11.18,16.8
PIN37  (via drill 0.2)
  Top 0.152: v12,16 IC2.D3
  Bottom 0.152: JP3.7 9.38,21.32 11.6,19.1 11.6,16.4 v12,16
PIN38  (via drill 0.2)
  Top 0.152: v12.8,16.8 IC2.C4
  Bottom 0.152: JP3.9 11.92,20.58 12.8,19.7 v12.8,16.8
PIN39  (via drill 0.2)
  Top 0.152: v14.4,16 IC2.D6
  Bottom 0.152: JP3.11 14.46,21.36 14,20.9 14,16.4 v14.4,16
PIN40  (via drill 0.2)
  Top 0.152: v15.2,16.8 IC2.C7
  Bottom 0.152: v15.2,16.8 15.2,20.1 17,21.9
  Bottom 0.203: JP3.13 17,21.9
PIN41  (via drill 0.2)
  Top 0.152: v16.8,16 IC2.D9
  Bottom 0.152: v16.8,16 16.4,16.4 16.4,18.7 19.54,21.84
  Bottom 0.203: JP3.15 19.54,21.84
PIN42  (via drill 0.2)
  Top 0.152: v17.6,16.8 IC2.C10
  Bottom 0.152: JP3.17 22.08,21.78 19.7,19.4 19.6,19.4 17.6,17.4 v17.6,16.8
PIN43  (via drill 0.2)
  Top 0.152: v18.4,16.8 IC2.C11
  Bottom 0.152: v18.4,16.8 19,16.8 24.13,21.93
  Bottom 0.203: JP3.19 24.52,21.93 24.13,21.93
PIN44  (via drill 0.2)
  Top 0.152: v18.4,16.05 18,15.65 IC2.D11
  Bottom 0.152: JP3.21 26.09,23.1 23.8,23.1 23.2,22.5 23.2,21.7 22.4,20.9 21.8,20.9 19.9,19 19.8,19 18,17.2 18,16.45 v18.4,16.05
POW:1V1UP
  Top 0.254: POW:IC1.3 4.07,7.32 | 4.07,7.32 4.6,7.85 4.6,8.6 4.4,8.8 3,8.8 2.4,9.4 2.4,10.55 POW:R9.2 3.75,11.15 5,12.4 POW:IC2.5 5,13.3 4.9,13.4 4.9,13.8 4.05,14.65 POW:IC3.1 | POW:IC4.3 5.15,6.25 4.07,7.32
POW:1V8UP
  Top 0.127: POW:IC3.5 5,18.59 4.97,18.62 4.97,18.98 5,19.01 5,19.2 5.1,19.3 8.7,19.3 8.8,19.2 8.8,15.85 9.45,15.2 12.6,15.2 12.8,15 12.8,4.86 13.05,4.61 16.4,4.61 16.61,4.4 17.4,4.4 17.61,4.61 25.79,4.61 26,4.4 26.83,4.4 26.83,4.41 27.4,4.41 27.42,4.43 27.97,4.43 28.4,4 28.8,4 29.03,3.77 29.03,3.08 28.55,2.6 POW:IC5.3
  Top 0.254: POW:IC5.3 28.55,1.8 POW:R7.2
POW:N$1
  Top 0.254: POW:R5.1 POW:R4.2 1.3,7.35 POW:IC1.4
POW:N$2  (via drill 0.3)
  Top 0.508: v7.03,14.6 6.65,14.6 POW:IC3.3
  Bottom 0.508: v7.03,14.6 6.2,14.6 POW:L2.1
POW:N$3  (via drill 0.2)
  Top 0.254: v3,11.88 3,12.4 3.3,12.7 POW:IC2.6
  Bottom 0.254: v3,11.88 3.57,11.88 POW:C3.2 POW:R10.2 POW:R11.1
POW:N$4  (via drill 0.3)
  Top 0.508: v7.03,9.4 6.65,9.4 POW:IC2.3
  Bottom 0.508: v7.03,9.4 6.2,9.4 POW:L1.1
POW:N$5
  Top 0.254: POW:R3.1 POW:R1.2 8.1,6.05 POW:IC4.4
POW:N$6
  Top 0.254: POW:R6.1 POW:R2.2 28.75,5.1 POW:IC5.4
POW:N$7  (via drill 0.2)
  Top 0.254: v3,17 3,17.6 3.3,17.9 POW:IC3.6
  Bottom 0.254: POW:R13.1 POW:R12.2 POW:C10.2 v3,17
RAM_A0  (via drill 0.2)
  Top 0.127: IC2.M16 26.4,9.2 28.2,11 28.2,11.6 28.6,12 29.4,12 IC1.H8 30.2,12 30.2,11.66 30.4,11.46 v30.4,11.4
  Bottom 0.127: R23.2 31.8,11 31.4,11.4 v30.4,11.4
RAM_A1  (via drill 0.2)
  Top 0.127: IC2.K16 22.8,10.8 24,12 25.4,12 IC1.H3 26.4,11.8 v26.4,11.2
  Route15 0.127: v29.4,9.4 29.2,9.6 28.8,9.6 27.8,10.6 27.8,11.4 27.6,11.6 26.8,11.6 v26.4,11.2
  Bottom 0.127: R22.2 30.6,8.2 v29.4,9.4
RAM_A2  (via drill 0.2)
  Top 0.127: IC1.H7 28.6,12.4 27.8,11.6 27.8,11 27.4,10.6 v27,10.6 | v20.8,8.8 IC2.M14
  Route15 0.127: v29,8.4 27,10.4 v27,10.6
  Bottom 0.127: v27,10.6 27,10.4 26.6,10 25.98,10 25.8,10.18 24.58,10.18 24,9.6 21.6,9.6 v20.8,8.8 | R21.2 v29,8.4
RAM_A3  (via drill 0.2)
  Top 0.127: IC1.J2 v24.6,11.2 | v20,10.4 IC2.K13
  Route15 0.127: v25,8.4 24.6,8.8 v24.6,11.2
  Bottom 0.127: v24.6,11.2 24.34,11.2 23.96,10.82 21.62,10.82 21.6,10.8 20.6,10.8 20.2,10.4 v20,10.4 | R20.2 v25,8.4
RAM_A4  (via drill 0.2)
  Top 0.127: IC1.J8 v29.4,11.2 | v21.6,8.8 IC2.M15
  Bottom 0.127: v21.6,8.8 22.18,9.38 24.2,9.38 24.78,9.97 25.62,9.97 25.89,9.69 26.69,9.69 28.2,11.2 v29.4,11.2 30.6,10 31.85,10 R19.2
RAM_A5  (via drill 0.2)
  Top 0.127: IC1.J3 v25.4,11.2 | v20.8,10.4 IC2.K14
  Route15 0.127: v26.6,8.4 26.4,8.6 26.4,9.4 25.4,10.4 v25.4,11.2
  Bottom 0.127: v25.4,11.2 25,10.8 24.25,10.8 24.05,10.6 23,10.6 22.98,10.58 20.98,10.58 v20.8,10.4 | R18.2 v26.6,8.4
RAM_A6  (via drill 0.2)
  Top 0.127: IC1.J7 28.6,11.2 28.6,11 26.4,8.8 24.6,8.8 v24.2,8.4 IC2.N16
  Bottom 0.127: R17.2 v24.2,8.4
RAM_A7  (via drill 0.2)
  Top 0.127: IC2.K15 21.6,10.4 22.8,10.4 23.2,10.8 IC1.K2 25.4,10.4 v25.4,9.59
  Route15 0.127: v25.4,9.59 25.8,9.19 v25.8,8.4
  Bottom 0.127: v25.8,8.4 R16.2
RAM_A8  (via drill 0.2)
  Top 0.127: IC1.K8 v29.4,10.4 | v22.4,8 IC2.P16
  Bottom 0.127: v22.4,8 23.35,8.95 27.15,8.95 28.22,10.02 28.76,10.02 29.14,10.4 v29.4,10.4 30.4,9.4 R15.2
RAM_A9  (via drill 0.2)
  Top 0.127: IC1.K3 v26.2,10.4 | v20,9.6 IC2.L13
  Route15 0.127: v27.4,8.4 27.4,9.2 v26.2,10.4
  Bottom 0.127: v26.2,10.4 24.15,10.4 24.14,10.39 23.39,10.39 23,10 20.4,10 v20,9.6 | R14.2 v27.4,8.4
RAM_A10  (via drill 0.2)
  Top 0.127: IC2.J14 20.8,11.2 v21.65,11.2 22.8,11.2 23.97,12.37 24.97,12.37 IC1.H2
  Bottom 0.127: v21.65,11.2 21.41,11.2 21.4,11.19 20.53,11.19 20.12,10.78 19.84,10.78 19.61,10.55 R13.2
RAM_A11  (via drill 0.2)
  Top 0.127: IC1.K7 v28.6,10.4 | v21.6,8 IC2.P15
  Route15 0.127: v31,8.4 29.4,10 29,10 v28.6,10.4
  Bottom 0.127: v28.6,10.4 28,10.4 26.77,9.17 22.77,9.17 v21.6,8 | R12.2 31.4,8 v31,8.4
RAM_A12  (via drill 0.2)
  Top 0.127: IC1.L2 24.6,10.4 23.4,10.4 22.6,9.6 v20.8,9.6 IC2.L14 | v20,7.2 v20,8.8
  Bottom 0.127: R11.2 23.4,7.55 22.63,6.78 22.54,6.78 22.36,6.6 20.76,6.6 20.6,6.6 v20,7.2 | v20,8.8 v20.8,9.6
RAM_A13  (via drill 0.2)
  Top 0.127: IC1.L8 29.8,9 v31,9 | v31.97,7.23 31.93,7.2 23,7.2 22.75,6.95 22.45,6.95 22.2,7.2 21.6,7.2 IC2.R15
  Bottom 0.127: v31,9 31.64,9 31.69,8.95 31.7,8.95 R10.2 31.97,8.52 v31.97,7.23
RAM_BA0  (via drill 0.2)
  Top 0.127: IC2.H15 v21.6,12 23.22,12 23.6,12.4 23.78,12.58 24.46,12.58 24.82,12.94 24.82,13.02 IC1.G2
  Bottom 0.127: R9.2 19.61,11.85 19.84,11.62 21.22,11.62 v21.6,12
RAM_BA1  (via drill 0.2)
  Top 0.127: IC1.G3 27.4,11.6 v27.4,11.2 | v20,11.2 IC2.J13
  Route15 0.127: v28.8,9.2 27.4,10.6 v27.4,11.2
  Bottom 0.127: v27.4,11.2 27,11.2 26.6,11.6 23.6,11.6 23.2,11.2 22.4,11.2 22,11.6 21.5,11.6 21.31,11.4 20.4,11.4 20.2,11.2 v20,11.2 | R8.2 29.8,8.2 v28.8,9.2
RAM_BA2  (via drill 0.2)
  Top 0.127: IC2.G16 22.12,13.2 22.37,12.95 22.68,12.95 22.93,13.2 IC1.G1 24.2,13.6 v24.4,13.8
  Route15 0.127: v28.2,8.4 27.8,8.8 27.8,9.2 26.6,10.4 26.6,10.6 26.4,10.8 26.2,10.8 26,11 26,12.2 v24.4,13.8
  Bottom 0.127: R2.2 v28.2,8.4
RAM_CAS_N  (via drill 0.2)
  Top 0.127: IC1.G7 v28.4,13.2 | v22.52,13.33 22.26,13.6 21.8,13.6 21.4,13.2 IC2.G15
  Route15 0.127: v31.2,12.8 28.8,12.8 v28.4,13.2
  Bottom 0.127: v28.4,13.2 23.6,13.2 23.46,13.33 v22.52,13.33 | R26.2 31.85,12.8 v31.2,12.8
RAM_CK_N  (via drill 0.2)
  Top 0.127: IC1.F8 v29.4,13.6 | v20.8,12 IC2.J15 | R1.2 31.4,15 v31.2,15.2
  Top 0.152: IC1.F8 v29.4,14.4
  Bottom 0.127: v29.4,14.4 29.64,14.4 30.04,14.79 30.36,14.79 30.77,15.2 v31.2,15.2 | v29.4,13.6 29,13.2 29,12.2 28.8,12 27.2,12 26.8,12.4 23.6,12.4 23.2,12 23.18,12.02 22.84,12.02 22.46,12.4 21.45,12.4 21.05,12 v20.8,12
RAM_CK_P  (via drill 0.2)
  Top 0.127: IC2.J16 v22.6,11.6 | v30.2,14.4 IC1.E8 | R30.2 31.6,12.25 v31.3,12.25
  Bottom 0.127: 30.6,12.4 29.8,11.6 27,11.6 26.6,12 23.6,12 23.2,11.6 v22.6,11.6 | 30.6,12.4 30.6,14 | 30.6,12.4 30.9,12.4 31.04,12.25 v31.3,12.25
  Bottom 0.147: 30.6,14 v30.2,14.4
RAM_CKE  (via drill 0.2)
  Top 0.127: v29.4,15.2 28,15.2 27.2,14.4 25.6,14.4 25.2,14 IC1.F2 25,13.73 24.6,13.33 24.6,13.03 24.37,12.8 22.84,12.8 22.77,12.74 22.18,12.74 22.16,12.76 21.05,12.76 20.7,12.4 IC2.H14
  Bottom 0.127: R28.2 32,16.6 31.4,16 29.8,16 29.4,15.6 v29.4,15.2
RAM_CS_N  (via drill 0.2)
  Top 0.127: v27.8,12.8 27.81,12.81 29.16,12.81 29.55,13.2 IC1.G8 31,13.2 v31.2,13.4 | v19.2,13.6 IC2.G13
  Bottom 0.127: v19.2,13.6 19.4,13.6 19.82,13.18 22.13,13.18 22.37,12.95 22.68,12.95 22.85,13.12 23.38,13.12 23.51,12.98 27.62,12.98 v27.8,12.8 | v31.2,13.4 R24.2
RAM_D0  (via drill 0.2)
  Top 0.127: IC1.C8 29.4,16.8 28,16.8 v27.6,17.2 | v21.6,16.8 IC2.B15
  Bottom 0.127: v27.6,17.2 26.91,17.2 arc-90 26.73,17.38 26.73,17.54 arc90 26.56,17.72 23.95,17.72 arc90 23.77,17.54 23.77,17.38 arc-90 23.6,17.2 23.2,17.2 22.8,16.8 v21.6,16.8
RAM_D1
  Top 0.127: IC1.C2 24.6,16 23.2,16 arc90 23,15.8 23,14.6 22.8,14.4 21.8,14.4 21.6,14.2 21.6,13.8 21.4,13.6 21,13.6 20.8,13.8 20.8,14.2 20.6,14.4 20.2,14.4 20,14.6 20,15.2 IC2.D14
RAM_D2  (via drill 0.2)
  Top 0.127: v22.6,14.8 IC2.E16 | IC1.D7 v28.4,15.6
  Bottom 0.127: v28.4,15.6 28,15.2 26,15.2 arc90 25.83,15.03 25.83,14.56 arc-90 25.65,14.38 25.5,14.38 arc-90 25.33,14.56 25.33,15.03 arc90 25.15,15.2 25.01,15.2 arc90 24.83,15.03 24.83,14.76 arc-90 24.58,14.51 arc-90 24.33,14.76 24.33,15.03 arc90 24.16,15.2 23.8,15.2 23.4,14.8 v22.6,14.8
RAM_D3  (via drill 0.2)
  Top 0.127: IC1.D3 25.6,15.6 25.2,15.2 24,15.2 23,14.2 v23,14 | v19.2,14.4 IC2.F13
  Bottom 0.127: v23,14 22.6,14.4 21.76,14.4 21.38,14.02 arc90 21.21,13.85 21.21,13.78 arc-90 21.13,13.7 20.66,13.7 arc-90 20.59,13.78 20.59,13.85 arc90 20.36,14.07 19.53,14.07 v19.2,14.4
RAM_D4  (via drill 0.2)
  Top 0.127: v19.25,15.2 18.6,15.2 18.4,15 18.4,14.4 IC2.F12 | IC1.D1 23.6,15.6 v23.4,15.4
  Bottom 0.127: v19.25,15.2 19.89,15.2 arc-90 19.94,15.25 20.01,15.25 arc-90 20.19,15.08 20.19,14.58 arc90 20.36,14.4 20.43,14.4 arc90 20.61,14.58 20.61,15.08 arc-90 20.78,15.25 20.85,15.25 arc-90 21.02,15.08 21.02,14.58 arc90 21.2,14.4 21.4,14.4 22.2,15.2 22.8,15.2 23,15.4 v23.4,15.4
RAM_D5  (via drill 0.2)
  Top 0.127: IC1.D9 30.2,16 27.8,16 v27,16.8 | v22.8,16.4 IC2.C16
  Bottom 0.127: v22.8,16.4 23,16.4 23.4,16.8
  Bottom 0.152: 23.4,16.8 24,16.8 arc90 24.19,16.99 24.19,17.14 arc-90 24.38,17.33 26.23,17.33 arc-90 26.41,17.14 26.41,16.99 arc90 26.6,16.8 v27,16.8
RAM_D6
  Top 0.127: IC1.B1 23.4,18 23.4,18.6 23.2,18.8 23,18.8 arc-90 22.82,18.98 22.82,19.16 arc90 22.65,19.34 22.56,19.34 arc90 22.39,19.16 22.39,18.98 arc-90 22.21,18.8 22.13,18.8 arc-90 21.95,18.98 21.95,19.16 arc90 21.78,19.34 21.69,19.34 arc90 21.52,19.16 21.52,18.98 arc-90 21.34,18.8 21.25,18.8 arc-90 21.08,18.98 21.08,19.16 arc90 20.91,19.34 20.82,19.34 arc90 20.64,19.16 20.64,18.98 arc-90 20.47,18.8 20.2,18.8 20,18.6 20,16.8 IC2.C14
RAM_D7  (via drill 0.2)
  Top 0.089: IC2.B16 v22.6,17.2
  Top 0.127: v30.2,17.6 IC1.B9
  Bottom 0.127: v30.2,17.6 29.8,18 25.6,18 arc-90 25.42,18.17 25.42,18.34 arc90 25.25,18.52 24.94,18.52 arc90 24.77,18.34 24.77,18.17 arc-90 24.59,18 23.4,18 v22.6,17.2
RAM_DM
  Top 0.127: IC1.B3 25.4,16.8 23.6,16.8 23.4,17 23.4,17.4 23.2,17.6 23.02,17.6 arc-90 22.85,17.77 22.85,17.88 arc90 22.67,18.06 22.55,18.06 arc90 22.38,17.88 22.38,17.77 arc-90 22.2,17.6 21,17.6 20.8,17.4 20.8,14.6 21.2,14.2 IC2.F15
RAM_DQS_N  (via drill 0.2)
  Top 0.127: IC2.E15 v21.6,15.2 | v29.4,17.6 IC1.A8
  Bottom 0.127: v29.4,17.6 28.6,16.8 28.1,16.8 27.09,15.78 22.78,15.78 22.6,15.6 22,15.6 v21.6,15.2
RAM_DQS_P  (via drill 0.2)
  Top 0.127: v28.4,17.2 IC1.B7 | v22.4,16 IC2.D16
  Bottom 0.127: v28.4,17.2 28.2,17.2 27,16 26,16 arc-90 25.83,16.17 25.83,16.56 arc90 25.65,16.73 25.58,16.73 arc90 25.4,16.56 25.4,16.17 arc-90 25.23,16 25.16,16 arc-90 24.98,16.17 24.98,16.56 arc90 24.81,16.73 24.73,16.73 arc90 24.56,16.56 24.56,16.17 arc-90 24.38,16 v22.4,16
RAM_ODT  (via drill 0.2)
  Top 0.127: IC2.F16 22.4,14 22.8,13.6 v23.8,13.6 | IC1.F9 v31.2,14
  Top 0.147: IC1.F9 v30.2,13.6
  Bottom 0.127: v30.2,13.6 29.8,14 29,14 28.6,13.6 26,13.6 25.82,13.42 23.98,13.42 v23.8,13.6 | v31.2,14 31.85,14
  Bottom 0.152: 31.85,14 R29.2
RAM_RAS_N  (via drill 0.2)
  Top 0.127: IC1.F7 v28.4,14 | IC2.F14 v20,13.6
  Bottom 0.127: 20.13,13.47 21.47,13.47 22,14 22.4,14 22.8,13.6 23.2,13.6 23.6,14 24,14 24.29,14.29 25.08,14.29 25.2,14.17 25.95,14.17 26.08,14.29 26.31,14.29 26.6,14 v28.4,14 28.45,14 29.02,14.57 29.02,14.62 29.2,14.8 29.6,14.8 29.8,15 29.8,15.4 30,15.6 31.85,15.6 R25.2
  Bottom 0.147: 20.13,13.47 v20,13.6
RAM_WE_N  (via drill 0.2)
  Top 0.127: IC1.F3 26.6,13.2 | 26.6,13.2 v27.4,12.4 | v20,12 IC2.H13 | v27.8,14.4 26.6,13.2
  Bottom 0.127: v27.4,12.4 27.03,12.77 23.37,12.77 23.36,12.78 22.82,12.78 22.67,12.64 21.15,12.64 20.89,12.38 20.7,12.38 20.62,12.38 20.24,12 v20,12 | R27.2 31.65,17.4 31.05,16.8 31,16.8 30.6,16.4 29.8,16.4 28.8,15.4 28.8,14.66 28.54,14.4 v27.8,14.4
RESET_N  (via drill 0.2)
  Top 0.127: IC2.R9 16,6.4 16,5.8 15.6,5.4 15.6,5.2 15.8,5 16.6,5 16.8,4.8 17.4,4.8 18.4,5.8 18.4,6.2 18.6,6.4 19,6.4 19.2,6.2 19.2,5.6 19.8,5 25.4,5 26.4,6 v27.2,6
  Bottom 0.127: v27.2,6 30.67,6 31.98,4.69 JP2.2
  Bottom 0.152: R31.1 32.55,4.12 31.98,4.69
TCK  (via drill 0.2)
  Top 0.127: v22.5,5.6 22.5,6.05 22.15,6.4 19.4,6.4 19.2,6.6 19.2,7 19,7.2 17.8,7.2 17.6,7 17.6,6.6 17.2,6.2 IC2.T10
  Bottom 0.127: JP1.1 25.09,3.51 24.8,3.8 23,3.8 22.5,4.3 v22.5,5.6
  Bottom 0.152: R32.2 22.05,6.05 v22.5,5.6
TDI  (via drill 0.2)
  Top 0.127: IC2.R11 18,6.6 17.6,6.2 17.6,5.8 17.4,5.6 16.4,5.6 v16.2,5.4
  Bottom 0.127: JP1.6 14.19,3.8 15.4,3.8 16.2,4.6 v16.2,5.4
TDO  (via drill 0.2)
  Top 0.127: IC2.M10 17.4,9.2 17.76,9.56 18.15,9.56 18.36,9.35 18.36,8.85 v18.4,8.8
  Bottom 0.127: v18.4,8.8 17.8,9.4 17.4,9.4 IC2.M10 14.31,9.2 14.29,9.22 11.02,9.22 10.8,9 10.8,2.95 JP1.7
TMS  (via drill 0.2)
  Top 0.127: IC2.T11 18,5.8 17.4,5.2 v17,5.2
  Bottom 0.127: v17,5.2 17,4 17.2,3.8 18.6,3.8 18.8,3.6 18.8,2.2 19,2 JP1.3
VCC  (via drill 0.2, 0.3)
  Top 0.127: v9.4,10.8 9.8,10.4 10.2,10.4 10.4,10.2 10.4,5.8 v9.6,5
  Top 0.203: IC2.G6 v14.4,12.8 IC2.G7 | IC2.L8 IC2.L9 v16.8,10.4 IC2.L10 | IC2.G9 v16.8,13.6
  Top 0.254: v2,13.6 1.4,13 POW:TP3.TP | v5,14.4 5.6,14.4 6.6,13.4 POW:C8.1
  Top 0.406: v9.4,10.8 v7.8,12.4
  Top 0.508: POW:C8.1 v7.8,12.4
  Bottom 0.127: JP1.8 9.6,4.29 v9.6,5
  Bottom 0.254: POW:L1.2 5.8,11.8 POW:C3.1 POW:R10.1 | v2,13.6 2,14.2 2.2,14.4 v5,14.4
  Bottom 0.305: C39.2 13.05,10.2 13.6,10.2
  Bottom 0.406: C39.2 C41.2 C40.2 C42.2 9.55,10.65 v9.4,10.8 | C31.2 10.2,13.4 | C30.2 11,13.4 | C37.2 11.8,13.4 | C38.2 12.6,13.4
  Bottom 0.508: POW:C8.1 v7.8,12.4 7,11.6 POW:L1.2
  Bottom 0.813: v14.4,12.8 14.32,12.87 14.1,12.87 13.57,13.4 12.6,13.4 11.8,13.4 11,13.4 10.2,13.4 POW:C8.1
  pour Bottom (no thermals): 13.6,14.4 18.4,14.4 18.4,9.6 13.6,9.6
VCCAUX  (via drill 0.2, 0.3)
  Top 0.203: IC2.L7 15,10 15.4,9.6 v16.8,9.6 17.4,9.6 17.6,9.8 17.6,12.8 IC2.G11
  Top 0.254: v1.4,6.2 0.8,6.2 0.58,6.42 0.58,7.73 POW:R4.1 1.05,9.25 POW:TP4.TP
  Top 0.508: POW:IC1.5 1.3,6.1 v1.4,6.2
  Bottom 0.406: POW:C13.1 2.6,4.2 8.8,4.2 9,4.4 9,6.7 9.4,7.1 10.1,7.1 10.35,7.35 10.35,9.2 10.75,9.6 v16.8,9.6
  Bottom 0.508: v1.4,6.2 1.6,6 POW:C13.1
VIN  (via drill 0.2, 0.3)
  Top 0.254: POW:IC2.4 5.95,11.95 5.8,11.8 5,11.8 4.05,10.85 POW:IC2.1 4,10.05 POW:R9.1 | POW:TP1.TP v1.4,18.6 | POW:R7.1 26.65,1.8 POW:IC5.1
  Top 0.406: POW:JP1.2 1.93,3.73 2.2,4 25.6,4 25.95,3.65 26.65,3.65
  Top 0.508: v5.4,13.6 5.46,13.54 5.49,13.54 5.95,13.08 POW:IC2.4 | POW:IC4.1 6.65,8.15 7,7.8 v7,7.2 | v2.4,6.2 2.4,5.6 2.75,5.25 POW:IC1.1 | v5.4,18.8 5.46,18.74 5.49,18.74 5.95,18.28 POW:IC3.4 | POW:IC5.1 26.65,3.65 27,4 v27.6,4
  Bottom 0.508: POW:C2.1 5.8,13.6 v5.4,13.6 | v7,7.2 6,7.2 5.8,7.4 POW:C15.1 | POW:C14.1 3.6,6 3.4,6.2 v2.4,6.2 | POW:C9.1 5.8,18.8 v5.4,18.8 | v27.6,4 27.6,3 27.4,2.8 POW:C5.1
  pour Route15 (isolate 0.254): 0.45,19.3 6.8,19.3 6.8,0.45 0.45,0.45
VTT  (via drill 0.2, 0.3)
  Top 0.127: IC1.E2 25.18,14.98 25.29,14.98 25.51,15.2 26.6,15.2 v27,14.8 | IC2.G14 v20,12.8 | IC2.R16 22.2,6.8 22.6,6.4 v22.7,6.4
  Top 0.203: C2.1 32.6,12.25 32.6,9.6 32.4,9.4 C27.2 | C36.2 31.83,8.17 | 31.83,8.17 32.05,8.4 C33.2 | 31.83,8.17 32.2,7.8 v32.4,7.8
  Top 0.254: POW:R2.1 29.13,5.82 27.82,5.82 27.6,5.6 v27.6,5
  Top 0.305: C36.2 C34.2 C24.2 C35.2 C29.2 C32.2 C28.2 C25.2 | C33.2 C27.2 | C26.2 32.05,18.45 32.4,18.8 32.8,18.8 33.2,18.4 v33.2,18.2
  Top 0.508: v27.6,5 27.5,5.1 POW:IC5.5
  Route15 0.127: v23.4,6 23.4,6.7 23.3,6.8 21.2,6.8 v19.2,8.8 | v27,14.8 27.6,14.8 28,15.2 28.8,15.2 29,15.4 29,15.6 29.2,15.8 31.4,15.8 33.2,17.6 v33.2,18.2
  Bottom 0.127: R11.1 23.4,6.6 | 23.4,6.6 v23.4,6 POW:TP7.TP | v19.2,8.8 R13.1 18.75,9.9 18.75,11.01 18.78,11.04 18.78,11.36 18.75,11.39 18.75,12.5 R9.1 19.35,12.8 v20,12.8 | v22.7,6.4 23.2,6.4 23.4,6.6
  Bottom 0.203: v32.4,7.8 32.7,7.5 32.7,7.3
  Bottom 0.305: v33.2,18.2 33.15,18.15 R27.1 R28.1 R25.1 32.6,15.8 32.6,14.2 R29.1 R24.1 R26.1 32.6,12.6 32.6,11 R23.1 R19.1 R15.1 R10.1 33.2,8.55 33.2,7.8 32.7,7.3 32.05,6.65 R12.1 R22.1 R8.1 R21.1 R2.1 R14.1 R18.1 R16.1 R20.1 R17.1 24.15,6.6 23.4,6.6
  Bottom 0.508: v27.6,5 27.4,4.8 POW:C4.1 R18.1